# Altium project stm32f373-relay-control.PrjPcb
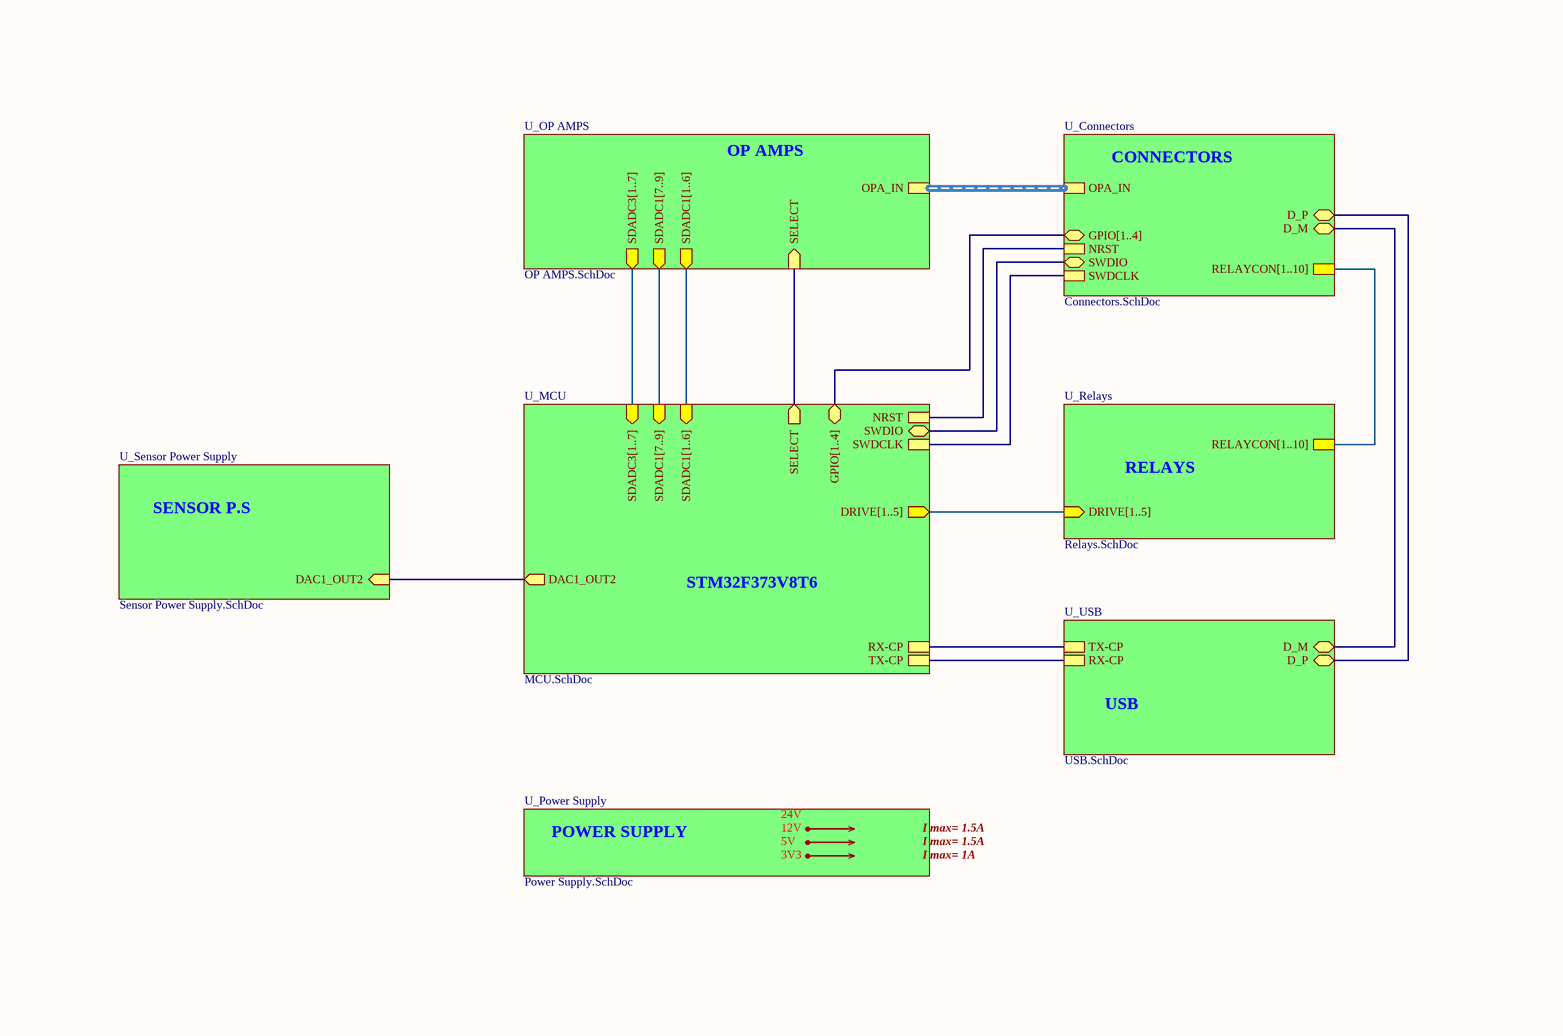
[diagram p0: stm32f373-relay-control.SchDoc]
8 sheets, 178 parts. Net scope: hierarchical (ports join the sheet entries above them; power ports are global).
Board file: stm32f373-relay-control.PcbDoc
Sheets:
  stm32f373-relay-control.SchDoc
    U_Connectors = Connectors.SchDoc
    U_OP AMPS = OP AMPS.SchDoc
    U_Power Supply = Power Supply.SchDoc
    U_Relays = Relays.SchDoc
    U_Sensor Power Supply = Sensor Power Supply.SchDoc
    U_USB = USB.SchDoc
    U_MCU = MCU.SchDoc

## Sheet stm32f373-relay-control.SchDoc: stm32f373-relay-control
size A4; Engineer: M.GUENI; Revision: R0; SheetNumber: 1; SheetTotal: 8

### Sub-sheets
U_Connectors = Connectors.SchDoc: RELAYCON[1..10], OPA_IN (harness OPA_IN), D_P (bidir), D_M (bidir), SWDIO (bidir), SWDCLK, NRST, GPIO[1..4] (bidir)
U_MCU = MCU.SchDoc: SDADC3[1..7] (in), SDADC1[1..6] (in), SDADC1[7..9] (in), DAC1_OUT2 (out), SELECT (out), DRIVE[1..5] (out), RX-CP, TX-CP, SWDIO (bidir), SWDCLK, NRST, GPIO[1..4] (bidir)
U_OP AMPS = OP AMPS.SchDoc: SDADC1[1..6] (out), SDADC1[7..9] (out), SDADC3[1..7] (out), OPA_IN (harness OPA_IN), SELECT (in)
U_Power Supply = Power Supply.SchDoc: no entries
U_Relays = Relays.SchDoc: RELAYCON[1..10], DRIVE[1..5] (in)
U_Sensor Power Supply = Sensor Power Supply.SchDoc: DAC1_OUT2 (in)
U_USB = USB.SchDoc: TX-CP, RX-CP, D_M (bidir), D_P (bidir)

### Nets
NRST: sheet U_Connectors/NRST, sheet U_MCU/NRST
SELECT: sheet U_OP AMPS/SELECT, sheet U_MCU/SELECT
NetD2_2: sheet U_Connectors/D_M, sheet U_USB/D_M
NetD2_3: sheet U_Connectors/D_P, sheet U_USB/D_P
NetJ11_1: sheet U_Connectors/SWDCLK, sheet U_MCU/SWDCLK
NetJ11_5: sheet U_Connectors/SWDIO, sheet U_MCU/SWDIO
NetR3_1: sheet U_USB/TX-CP, sheet U_MCU/RX-CP
NetR5_1: sheet U_USB/RX-CP, sheet U_MCU/TX-CP
NetU6_30: sheet U_Sensor Power Supply/DAC1_OUT2, sheet U_MCU/DAC1_OUT2

### Buses and harness runs
bus sheet U_Connectors/GPIO[1..4] = sheet U_MCU/GPIO[1..4]
bus sheet U_Connectors/RELAYCON[1..10] = sheet U_Relays/RELAYCON[1..10]
bus sheet U_MCU/DRIVE[1..5] = sheet U_Relays/DRIVE[1..5]
bus sheet U_MCU/SDADC1[1..6] = sheet U_OP AMPS/SDADC1[1..6]
bus sheet U_MCU/SDADC1[7..9] = sheet U_OP AMPS/SDADC1[7..9]
bus sheet U_MCU/SDADC3[1..7] = sheet U_OP AMPS/SDADC3[1..7]
harness sheet U_Connectors/OPA_IN = sheet U_OP AMPS/OPA_IN

### Notes on the sheet
- OP AMPS
- CONNECTORS
- SENSOR P.S
- RELAYS
- STM32F373V8T6
- USB
- POWER SUPPLY
- 12V
- 5V
- 24V
- I max= 1.5A
- 3V3
- I max= 1A
- THIS DOCUMENT AND THE DATA DISCLOSED HEREIN OR
- HEREWITH IS THE PROPERTY OF ALTIUM LIMITED AND MAY
- DWG NO:
- REVISION
- REV:
- DESCRIPTION
- DATE
- APPROVED
- BE FREELY DISTRIBUTED IN WHOLE. NO RIGHTS ARE
- RESERVED OR EXPRESS OR IMPLIED WARANTEE GIVEN.
- ENG:
- APPROVALS
- PROJECT
- DSN:
- CHK:
- REFERENCE DOCUMENTS
- PROJECT REVISION:
- TITLE
- DOCUMENT REVISION:
- DESIGN ITEM:
- BOM:
- FAB DWG:
- PCB DWG:
- ASSY DWG:
- SCALE:
- A3
- SIZE
- CAGE CODE
- FILE NAME
- DWG NO.
- SHEET
- OF
- REV

## Sheet Connectors.SchDoc: CONNECTORS
size A4; Engineer: M.GUENI; Organization: Altium Limited; Address1: L3, 12a Rodborough Rd; Address2: Frenchs Forest; Address3: NSW; Address4: Australia 2086; Revision: R0; SheetNumber: 4; SheetTotal: 8
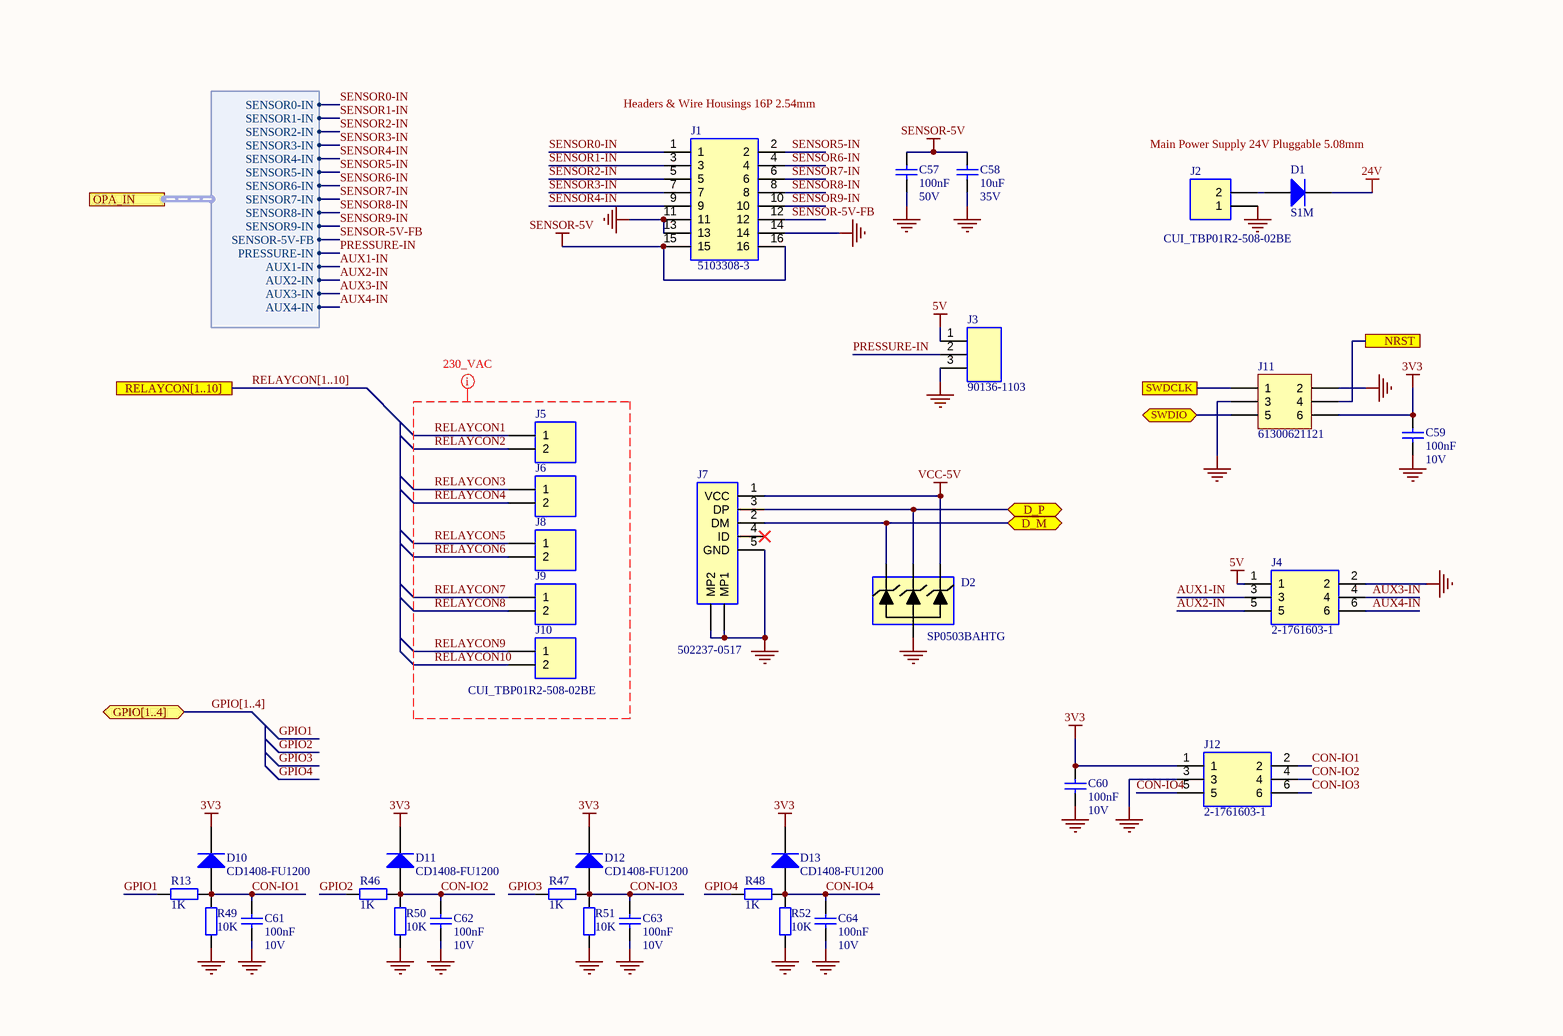
[diagram p1: Connectors.SchDoc]

### Parts
C57  Value 1: 100nF  Value 2: 50V  [CAPC1608N]  (hidden comment: Capacitor)
C58  Value 1: 10uF  Value 2: 35V  [CAPC1608N]  (hidden comment: Capacitor)
C59  Value 1: 100nF  Value 2: 10V  [CAPC1608N]  (hidden comment: Capacitor)
C60  Value 1: 100nF  Value 2: 10V  [CAPC1608N]  (hidden comment: Capacitor)
C61  Value 1: 100nF  Value 2: 10V  [CAPC1608N]  (hidden comment: Capacitor)
C62  Value 1: 100nF  Value 2: 10V  [CAPC1608N]  (hidden comment: Capacitor)
C63  Value 1: 100nF  Value 2: 10V  [CAPC1608N]  (hidden comment: Capacitor)
C64  Value 1: 100nF  Value 2: 10V  [CAPC1608N]  (hidden comment: Capacitor)
D1  S1M  [DIOM5227X270N]
D2  SP0503BAHTG  [SOT-143]
D10  CD1408-FU1200  [SOD-87]
D11  CD1408-FU1200  [SOD-87]
D12  CD1408-FU1200  [SOD-87]
D13  CD1408-FU1200  [SOD-87]
J1  5103308-3  [5103308-3]
J2  CUI_TBP01R2-508-02BE  [CUI_TBP01R2-508-02BE]
J3  90136-1103  [HDR1X3]
J4  2-1761603-1  [2-1761603-1]
J5  CUI_TBP01R2-508-02BE  [CUI_TBP01R2-508-02BE]
J6  CUI_TBP01R2-508-02BE  [CUI_TBP01R2-508-02BE]  (value not drawn)
J7  502237-0517  [502237-0517]
J8  CUI_TBP01R2-508-02BE  [CUI_TBP01R2-508-02BE]  (value not drawn)
J9  CUI_TBP01R2-508-02BE  [CUI_TBP01R2-508-02BE]  (value not drawn)
J10  CUI_TBP01R2-508-02BE  [CUI_TBP01R2-508-02BE]  (value not drawn)
J11  61300621121  [HDR2X3]
J12  2-1761603-1  [2-1761603-1]
R13  Value 1: 1K  [RESC1608N]  (hidden comment: Resistor)
R46  Value 1: 1K  [RESC1608N]  (hidden comment: Resistor)
R47  Value 1: 1K  [RESC1608N]  (hidden comment: Resistor)
R48  Value 1: 1K  [RESC1608N]  (hidden comment: Resistor)
R49  Value 1: 10K  [RESC1608N]  (hidden comment: Resistor)
R50  Value 1: 10K  [RESC1608N]  (hidden comment: Resistor)
R51  Value 1: 10K  [RESC1608N]  (hidden comment: Resistor)
R52  Value 1: 10K  [RESC1608N]  (hidden comment: Resistor)

### Ports
D_M (bidir), D_P (bidir), GPIO[1..4] (bidir), NRST, OPA_IN (harness OPA_IN), RELAYCON[1..10], SWDCLK, SWDIO (bidir)

### Harnesses
OPA_IN: SENSOR2-IN, SENSOR3-IN, SENSOR4-IN, SENSOR5-IN, SENSOR6-IN, SENSOR7-IN, SENSOR8-IN, SENSOR9-IN, SENSOR-5V-FB, PRESSURE-IN, AUX1-IN, AUX2-IN, SENSOR1-IN, AUX3-IN, SENSOR0-IN, AUX4-IN

### Nets
3V3: C59.2 C60.2 D10.1(K) D11.1(K) D12.1(K) D13.1(K) J11.6 J12.1
5V: J3.1 J4.1
24V: D1.1(K)
GND: C57.2 C58.2 C59.1 C60.1 C61.1 C62.1 C63.1 C64.1 D2.1 J1.11 J1.13 J1.14 J2.1 J3.3 J4.2 J7.5(GND) J7.MP1 J7.MP2 J11.2 J11.3 J12.3 R49.2 R50.2 R51.2 R52.2
SENSOR-5V: C57.1 C58.1 J1.15 J1.16
VCC-5V: D2.4 J7.1(VCC)
AUX1-IN: J4.3 ; port OPA_IN.AUX1-IN
AUX2-IN: J4.5 ; port OPA_IN.AUX2-IN
AUX3-IN: J4.4 ; port OPA_IN.AUX3-IN
AUX4-IN: J4.6 ; port OPA_IN.AUX4-IN
CON-IO1: C61.2 D10.2(A) J12.2 R13.1 R49.1
CON-IO2: C62.2 D11.2(A) J12.4 R46.1 R50.1
CON-IO3: C63.2 D12.2(A) J12.6 R47.1 R51.1
CON-IO4: C64.2 D13.2(A) J12.5 R48.1 R52.1
GPIO1: R13.2
GPIO2: R46.2
GPIO3: R47.2
GPIO4: R48.2
NRST: J11.4 ; port NRST
PRESSURE-IN: J3.2 ; port OPA_IN.PRESSURE-IN
RELAYCON1: J5.1
RELAYCON2: J5.2
RELAYCON3: J6.1
RELAYCON4: J6.2
RELAYCON5: J8.1
RELAYCON6: J8.2
RELAYCON7: J9.1
RELAYCON8: J9.2
RELAYCON9: J10.1
RELAYCON10: J10.2
SENSOR0-IN: J1.1 ; port OPA_IN.SENSOR0-IN
SENSOR1-IN: J1.3 ; port OPA_IN.SENSOR1-IN
SENSOR2-IN: J1.5 ; port OPA_IN.SENSOR2-IN
SENSOR3-IN: J1.7 ; port OPA_IN.SENSOR3-IN
SENSOR4-IN: J1.9 ; port OPA_IN.SENSOR4-IN
SENSOR5-IN: J1.2 ; port OPA_IN.SENSOR5-IN
SENSOR6-IN: J1.4 ; port OPA_IN.SENSOR6-IN
SENSOR7-IN: J1.6 ; port OPA_IN.SENSOR7-IN
SENSOR8-IN: J1.8 ; port OPA_IN.SENSOR8-IN
SENSOR9-IN: J1.10 ; port OPA_IN.SENSOR9-IN
SENSOR-5V-FB: J1.12 ; port OPA_IN.SENSOR-5V-FB
NetD1_2: D1.2(A) J2.2
NetD2_2: D2.2 J7.2(DM) ; port D_M
NetD2_3: D2.3 J7.3(DP) ; port D_P
NetJ11_1: J11.1 ; port SWDCLK
NetJ11_5: J11.5 ; port SWDIO

Not connected (* = marked no-connect by the designer): J7 4(ID)*

### Buses and harness runs
bus GPIO[1..4] = port GPIO[1..4]
bus RELAYCON[1..10] = port RELAYCON[1..10]

### Layout directives
net class 230_VAC: RELAYCON1, RELAYCON2, RELAYCON3, RELAYCON4, RELAYCON5, RELAYCON6, RELAYCON7, RELAYCON8, RELAYCON9, RELAYCON10

### Notes on the sheet
- (near J1) Headers & Wire Housings 16P 2.54mm
- Main Power Supply 24V Pluggable 5.08mm
- THIS DOCUMENT AND THE DATA DISCLOSED HEREIN OR
- HEREWITH IS THE PROPERTY OF ALTIUM LIMITED AND MAY
- DWG NO:
- REVISION
- REV:
- DESCRIPTION
- DATE
- APPROVED
- BE FREELY DISTRIBUTED IN WHOLE. NO RIGHTS ARE
- RESERVED OR EXPRESS OR IMPLIED WARANTEE GIVEN.
- ENG:
- APPROVALS
- PROJECT
- DSN:
- CHK:
- REFERENCE DOCUMENTS
- PROJECT REVISION:
- TITLE
- DOCUMENT REVISION:
- DESIGN ITEM:
- BOM:
- FAB DWG:
- PCB DWG:
- ASSY DWG:
- SCALE:
- A3
- SIZE
- CAGE CODE
- FILE NAME
- DWG NO.
- SHEET
- OF
- REV

### Library data of the parts
C57 = CAP-000000002: MAN: VISHAY; MANREF: VJ0603V104ZXAPW1BC; DES: VJ0603V104ZXAPW1BC -  Condensateur céramique multicouche CMS, 0.1 µF, 50 V, 0603 [1608 Metric], +80%, -20%, Y5V; TOL: +80% -20%; FTP: 0603; SUP: Farnell; SUPREF: 2896408; NOTE: _; Part Number: CAP-000000002
C58 = CAP-000000006: MAN: Murata Electronics; MANREF: GRM188R6YA106MA73D; DES: Multilayer Ceramic Capacitors MLCC - SMD/SMT 0603 10uF 35volts *Derate Voltage/Temp; TOL: 20%; FTP: 0603; SUP: Mouser; SUPREF: 81-GRM188R6YA106MA3D; NOTE: _; Part Number: CAP-000000006
C59-C64 = CAP-000000005: MAN: KEMET; MANREF: C0603X104K8RACTU; DES: C0603X104K8RACTU -  Condensateur céramique multicouche CMS, 0.1 µF, 10 V, 0603 [1608 Metric], ± 10%, X7R; TOL: 10%; FTP: 0603; SUP: Farnell; SUPREF: 2904937; NOTE: _; Part Number: CAP-000000005
D1 = DIR-000000001: MAN: ON Semiconductor / Fairchild; DES: Rectifiers 1.0A 1000V; Value 1: 1A; Value 2: 1000V; TOL: _; FTP: DO-214AC; SUP: Mouser; SUPREF: 512-S1M; Part Number: DIR-000000001; MANREF: S1M; NOTE: _
D2 = TVS-000000009: MAN: Littelfuse; DES: ESD Suppressors / TVS Diodes TVS AVAL DIODE SMT; Value 1: 5.5 V; Value 2: 30 pF; TOL: _; SUP: Mouser; SUPREF: 576-SP0503BAHTG; Part Number: TVS-000000009; MANREF: SP0503BAHTG; FTP: SOT-143; NOTE: _
D10-D13 = DIR-000000003: MAN: Bourns; DES: Rectifiers RECTIFIER DIODE SMD 200VOLT; Value 1: 1A; Value 2: 200 V; TOL: _; SUP: Mouser; SUPREF: 652-CD1408-FU1200; Part Number: DIR-000000003; MANREF: CD1408-FU1200; FTP: SOD-87; NOTE: _
J1 = CON-000000002: MAN: TE Connectivity; DES: Headers & Wire Housings 16P 2 ROW HEADER LP; Value 1: 16pts; Value 2: 2.54mm; TOL: _; FTP: THT; SUP: Mouser; SUPREF: 571-5103308-3; Part Number: CON-000000002; MANREF: 5103308-3; NOTE: _
J2 J5 J6 J8-J10 = CON-000000001: MAN: CUI Devices; MANREF: TBP01R2-508-02BE / 39910-0102; DES: Pluggable Terminal Blocks Terminal block, pluggable, 5.08, receptical, 2 pole, blue; Value 1: 2pts; Value 2: 5.08 mm; TOL: _; FTP: THT; SUP: Mouser; SUPREF: 490-TBP01R2-508-02BE; Part Number: CON-000000001; NOTE: _
J3 = CON-000000004: MAN: Molex; DES: Headers & Wire Housings 2.54MM CGRIDIII HDR 3P V SR SHRD TIN; Value 1: 3pts; Value 2: 2,54 mm; TOL: _; FTP: THT; SUP: Mouser; SUPREF: 538-90136-1103; Part Number: CON-000000004; MANREF: 90136-1103; NOTE: _
J4 J12 = CON-000000003: MAN: TE Connectivity; DES: Headers & Wire Housings IDC HDR 6P VERT BLUE LOW PRO; Value 1: 6pts; Value 2: 2.54mm; FTP: THT; SUP: Mouser; SUPREF: 571-2-1761603-1; NOTE: _; Part Number: CON-000000003; MANREF: 2-1761603-1
J7 = CON-000000005: MAN: Molex; DES: USB Connectors USB Mini-B Rec Hsg Assy S/T 5Ckt; Value 1: _; FTP: THT; SUP: Mouser; SUPREF: 538-502237-0517; Part Number: CON-000000005; MANREF: 502237-0517; Value 2: _; TOL: _; NOTE: _
J11 = CON-000000006: MAN: Wurth Electronics; DES: Embases et logements de câbles WR-PHD 2.54mm Hdr 6P Dual Str Gold; Value 1: 6pts; Value 2: _; FTP: THT; SUP: Mouser; SUPREF: 710-61300621121; Part Number: CON-000000006; MANREF: 61300621121; TOL: _; NOTE: _
R13 R46-R48 = RES-000000006: MAN: TE Connectivity / Neohm; MANREF: CPF0603F1K0C1; DES: Thin Film Resistors - SMD 1KOhm .063W 50PPM; Value 2: 0.625W; TOL: 1%; FTP: 0603; SUP: Mouser; SUPREF: 279-CPF0603F1K0C1; NOTE: _; Part Number: RES-000000006
R49-R52 = RES-000000001: MAN: YAGEO; MANREF: RC0603FR-0710KL; DES: YAGEO (PHYCOMP)  RC0603FR-0710KL  RESISTANCE COUCHE EPAISSE 10K 0.1W 1%; Value 2: 0.1W; TOL: 1%; FTP: 0603; SUP: Farnell; SUPREF: 9238603; NOTE: _; Part Number: RES-000000001

## Sheet OP AMPS.SchDoc
size 420 x 297 mm; Organization: Altium Limited; Address1: L3, 12a Rodborough Rd; Address2: Frenchs Forest; Address3: NSW; Address4: Australia 2086; Revision: R0; SheetNumber: 5; SheetTotal: 8
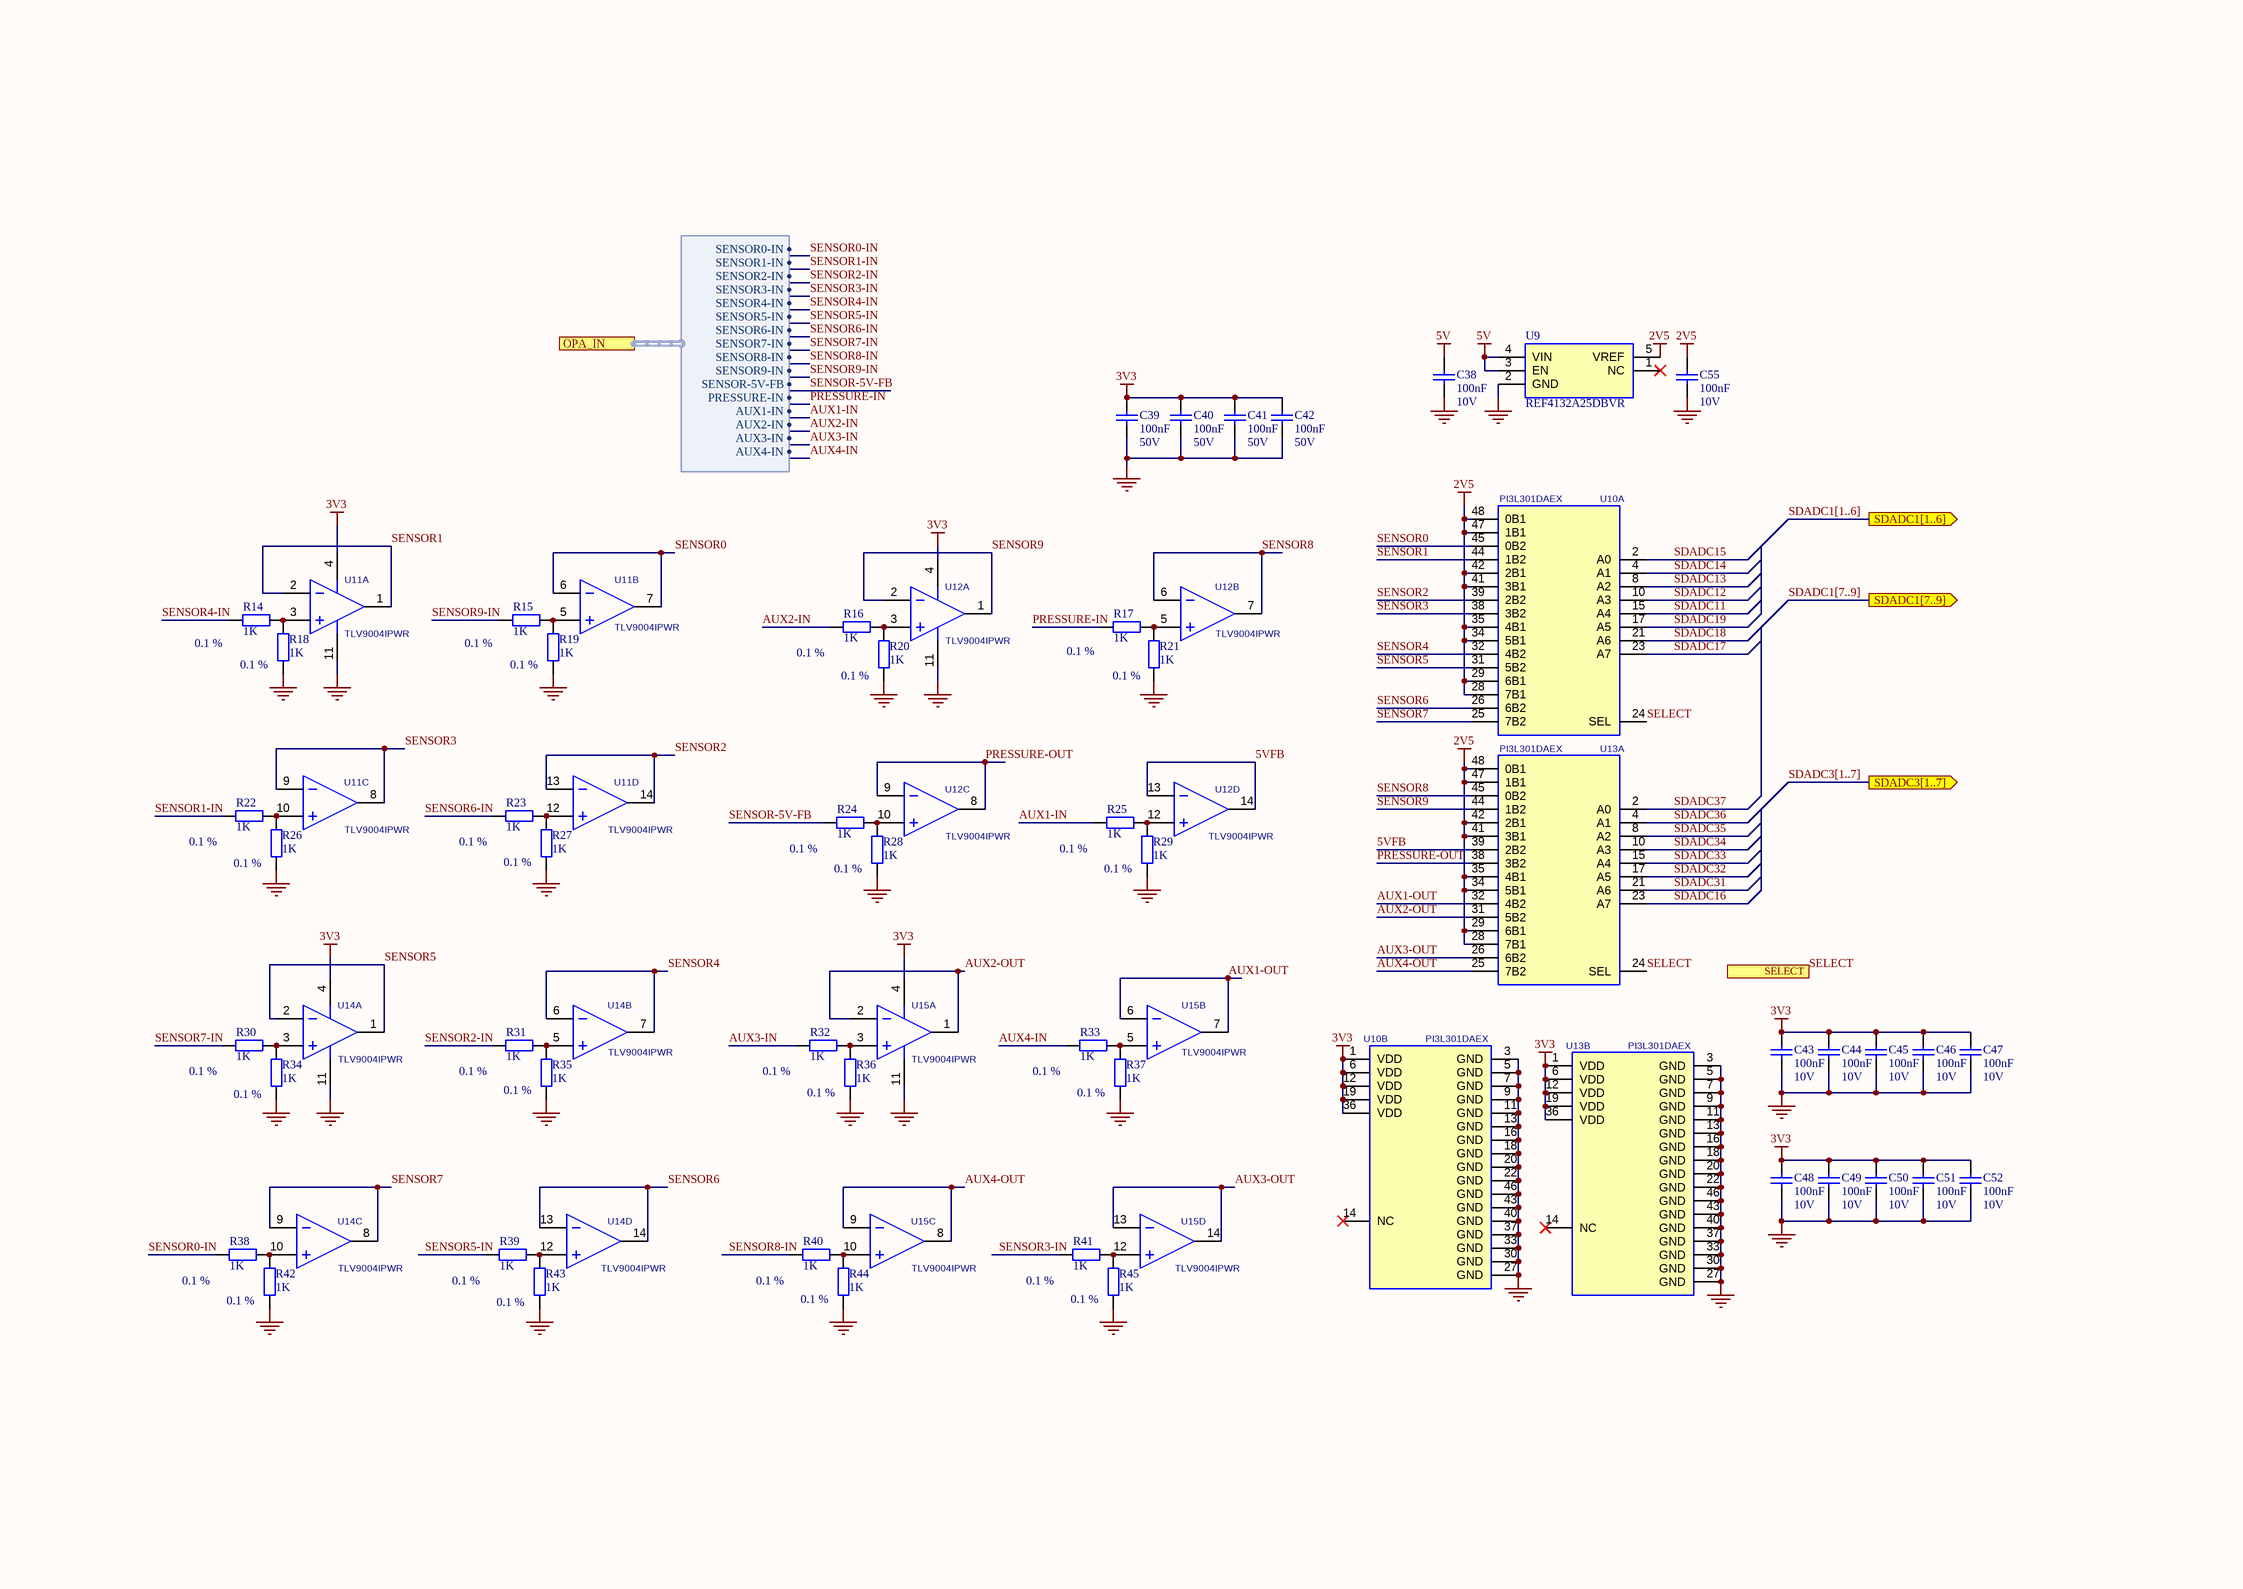
[diagram p2: OP AMPS.SchDoc]

### Parts
C38  Value 1: 100nF  Value 2: 10V  [CAPC1608N]  (hidden comment: Capacitor)
C39  Value 1: 100nF  Value 2: 50V  [CAPC1608N]  (hidden comment: Capacitor)
C40  Value 1: 100nF  Value 2: 50V  [CAPC1608N]  (hidden comment: Capacitor)
C41  Value 1: 100nF  Value 2: 50V  [CAPC1608N]  (hidden comment: Capacitor)
C42  Value 1: 100nF  Value 2: 50V  [CAPC1608N]  (hidden comment: Capacitor)
C43  Value 1: 100nF  Value 2: 10V  [CAPC1608N]  (hidden comment: Capacitor)
C44  Value 1: 100nF  Value 2: 10V  [CAPC1608N]  (hidden comment: Capacitor)
C45  Value 1: 100nF  Value 2: 10V  [CAPC1608N]  (hidden comment: Capacitor)
C46  Value 1: 100nF  Value 2: 10V  [CAPC1608N]  (hidden comment: Capacitor)
C47  Value 1: 100nF  Value 2: 10V  [CAPC1608N]  (hidden comment: Capacitor)
C48  Value 1: 100nF  Value 2: 10V  [CAPC1608N]  (hidden comment: Capacitor)
C49  Value 1: 100nF  Value 2: 10V  [CAPC1608N]  (hidden comment: Capacitor)
C50  Value 1: 100nF  Value 2: 10V  [CAPC1608N]  (hidden comment: Capacitor)
C51  Value 1: 100nF  Value 2: 10V  [CAPC1608N]  (hidden comment: Capacitor)
C52  Value 1: 100nF  Value 2: 10V  [CAPC1608N]  (hidden comment: Capacitor)
C55  Value 1: 100nF  Value 2: 10V  [CAPC1608N]  (hidden comment: Capacitor)
R14  Value 1: 1K  TOL: 0.1 %  [RESC1608N]  (hidden comment: Resistor)
R15  Value 1: 1K  TOL: 0.1 %  [RESC1608N]  (hidden comment: Resistor)
R16  Value 1: 1K  TOL: 0.1 %  [RESC1608N]  (hidden comment: Resistor)
R17  Value 1: 1K  TOL: 0.1 %  [RESC1608N]  (hidden comment: Resistor)
R18  Value 1: 1K  TOL: 0.1 %  [RESC1608N]  (hidden comment: Resistor)
R19  Value 1: 1K  TOL: 0.1 %  [RESC1608N]  (hidden comment: Resistor)
R20  Value 1: 1K  TOL: 0.1 %  [RESC1608N]  (hidden comment: Resistor)
R21  Value 1: 1K  TOL: 0.1 %  [RESC1608N]  (hidden comment: Resistor)
R22  Value 1: 1K  TOL: 0.1 %  [RESC1608N]  (hidden comment: Resistor)
R23  Value 1: 1K  TOL: 0.1 %  [RESC1608N]  (hidden comment: Resistor)
R24  Value 1: 1K  TOL: 0.1 %  [RESC1608N]  (hidden comment: Resistor)
R25  Value 1: 1K  TOL: 0.1 %  [RESC1608N]  (hidden comment: Resistor)
R26  Value 1: 1K  TOL: 0.1 %  [RESC1608N]  (hidden comment: Resistor)
R27  Value 1: 1K  TOL: 0.1 %  [RESC1608N]  (hidden comment: Resistor)
R28  Value 1: 1K  TOL: 0.1 %  [RESC1608N]  (hidden comment: Resistor)
R29  Value 1: 1K  TOL: 0.1 %  [RESC1608N]  (hidden comment: Resistor)
R30  Value 1: 1K  TOL: 0.1 %  [RESC1608N]  (hidden comment: Resistor)
R31  Value 1: 1K  TOL: 0.1 %  [RESC1608N]  (hidden comment: Resistor)
R32  Value 1: 1K  TOL: 0.1 %  [RESC1608N]  (hidden comment: Resistor)
R33  Value 1: 1K  TOL: 0.1 %  [RESC1608N]  (hidden comment: Resistor)
R34  Value 1: 1K  TOL: 0.1 %  [RESC1608N]  (hidden comment: Resistor)
R35  Value 1: 1K  TOL: 0.1 %  [RESC1608N]  (hidden comment: Resistor)
R36  Value 1: 1K  TOL: 0.1 %  [RESC1608N]  (hidden comment: Resistor)
R37  Value 1: 1K  TOL: 0.1 %  [RESC1608N]  (hidden comment: Resistor)
R38  Value 1: 1K  TOL: 0.1 %  [RESC1608N]  (hidden comment: Resistor)
R39  Value 1: 1K  TOL: 0.1 %  [RESC1608N]  (hidden comment: Resistor)
R40  Value 1: 1K  TOL: 0.1 %  [RESC1608N]  (hidden comment: Resistor)
R41  Value 1: 1K  TOL: 0.1 %  [RESC1608N]  (hidden comment: Resistor)
R42  Value 1: 1K  TOL: 0.1 %  [RESC1608N]  (hidden comment: Resistor)
R43  Value 1: 1K  TOL: 0.1 %  [RESC1608N]  (hidden comment: Resistor)
R44  Value 1: 1K  TOL: 0.1 %  [RESC1608N]  (hidden comment: Resistor)
R45  Value 1: 1K  TOL: 0.1 %  [RESC1608N]  (hidden comment: Resistor)
U9  REF4132A25DBVR  [SOT-23-5]
U10  PI3L301DAEX  [SOP-48]  (parts A,B of 2)
U11  TLV9004IPWR  [TSSOP-14]  (parts A,B,C,D of 4)
U12  TLV9004IPWR  [TSSOP-14]  (parts A,B,C,D of 4)
U13  PI3L301DAEX  [SOP-48]  (parts A,B of 2)
U14  TLV9004IPWR  [TSSOP-14]  (parts A,B,C,D of 4)
U15  TLV9004IPWR  [TSSOP-14]  (parts A,B,C,D of 4)

### Ports
OPA_IN (harness OPA_IN), SDADC1[1..6] (out), SDADC1[7..9] (out), SDADC3[1..7] (out), SELECT (in)

### Harnesses
OPA_IN: SENSOR2-IN, SENSOR3-IN, SENSOR4-IN, SENSOR5-IN, SENSOR6-IN, SENSOR7-IN, SENSOR8-IN, SENSOR9-IN, SENSOR-5V-FB, PRESSURE-IN, AUX1-IN, AUX2-IN, SENSOR1-IN, AUX3-IN, SENSOR0-IN, AUX4-IN

### Nets
2V5: C55.2 U9.5(VREF) U10.28(7B1) U10.29(6B1) U10.34(5B1) U10.35(4B1) U10.41(3B1) U10.42(2B1) U10.47(1B1) U10.48(0B1) U13.28(7B1) U13.29(6B1) U13.34(5B1) U13.35(4B1) U13.41(3B1) U13.42(2B1) U13.47(1B1) U13.48(0B1)
3V3: C39.1 C40.1 C41.1 C42.1 C43.2 C44.2 C45.2 C46.2 C47.2 C48.2 C49.2 C50.2 C51.2 C52.2 U10.1(VDD) U10.6(VDD) U10.12(VDD) U10.19(VDD) U10.36(VDD) U11.4(+V) U12.4(+V) U13.1(VDD) U13.6(VDD) U13.12(VDD) U13.19(VDD) U13.36(VDD) U14.4(+V) U15.4(+V)
5V: C38.2 U9.3(EN) U9.4(VIN)
GND: C38.1 C39.2 C40.2 C41.2 C42.2 C43.1 C44.1 C45.1 C46.1 C47.1 C48.1 C49.1 C50.1 C51.1 C52.1 C55.1 R18.2 R19.2 R20.2 R21.2 R26.2 R27.2 R28.2 R29.2 R34.2 R35.2 R36.2 R37.2 R42.2 R43.2 R44.2 R45.2 U9.2(GND) U10.3(GND) U10.5(GND) U10.7(GND) U10.9(GND) U10.11(GND) U10.13(GND) U10.16(GND) U10.18(GND) U10.20(GND) U10.22(GND) U10.27(GND) U10.30(GND) U10.33(GND) U10.37(GND) U10.40(GND) U10.43(GND) U10.46(GND) U11.11(-V) U12.11(-V) U13.3(GND) U13.5(GND) U13.7(GND) U13.9(GND) U13.11(GND) U13.13(GND) U13.16(GND) U13.18(GND) U13.20(GND) U13.22(GND) U13.27(GND) U13.30(GND) U13.33(GND) U13.37(GND) U13.40(GND) U13.43(GND) U13.46(GND) U14.11(-V) U15.11(-V)
5VFB: U12.13(–IN_D) U12.14(OUT_D) U13.39(2B2)
AUX1-IN: R25.1 ; port OPA_IN.AUX1-IN
AUX1-OUT: U13.32(4B2) U15.6(–IN_B) U15.7(OUT_B)
AUX2-IN: R16.1 ; port OPA_IN.AUX2-IN
AUX2-OUT: U13.31(5B2) U15.1(OUT_A) U15.2(-IN_A)
AUX3-IN: R32.1 ; port OPA_IN.AUX3-IN
AUX3-OUT: U13.26(6B2) U15.13(–IN_D) U15.14(OUT_D)
AUX4-IN: R33.1 ; port OPA_IN.AUX4-IN
AUX4-OUT: U13.25(7B2) U15.8(OUT_C) U15.9(–IN_C)
PRESSURE-IN: R17.1 ; port OPA_IN.PRESSURE-IN
PRESSURE-OUT: U12.8(OUT_C) U12.9(–IN_C) U13.38(3B2)
SDADC11: U10.15(A4)
SDADC12: U10.10(A3)
SDADC13: U10.8(A2)
SDADC14: U10.4(A1)
SDADC15: U10.2(A0)
SDADC16: U13.23(A7)
SDADC17: U10.23(A7)
SDADC18: U10.21(A6)
SDADC19: U10.17(A5)
SDADC31: U13.21(A6)
SDADC32: U13.17(A5)
SDADC33: U13.15(A4)
SDADC34: U13.10(A3)
SDADC35: U13.8(A2)
SDADC36: U13.4(A1)
SDADC37: U13.2(A0)
SELECT: U10.24(SEL) U13.24(SEL) ; port SELECT
SENSOR0: U10.45(0B2) U11.6(–IN_B) U11.7(OUT_B)
SENSOR0-IN: R38.1 ; port OPA_IN.SENSOR0-IN
SENSOR1: U10.44(1B2) U11.1(OUT_A) U11.2(-IN_A)
SENSOR1-IN: R22.1 ; port OPA_IN.SENSOR1-IN
SENSOR2: U10.39(2B2) U11.13(–IN_D) U11.14(OUT_D)
SENSOR2-IN: R31.1 ; port OPA_IN.SENSOR2-IN
SENSOR3: U10.38(3B2) U11.8(OUT_C) U11.9(–IN_C)
SENSOR3-IN: R41.1 ; port OPA_IN.SENSOR3-IN
SENSOR4: U10.32(4B2) U14.6(–IN_B) U14.7(OUT_B)
SENSOR4-IN: R14.1 ; port OPA_IN.SENSOR4-IN
SENSOR5: U10.31(5B2) U14.1(OUT_A) U14.2(-IN_A)
SENSOR5-IN: R39.1 ; port OPA_IN.SENSOR5-IN
SENSOR6: U10.26(6B2) U14.13(–IN_D) U14.14(OUT_D)
SENSOR6-IN: R23.1 ; port OPA_IN.SENSOR6-IN
SENSOR7: U10.25(7B2) U14.8(OUT_C) U14.9(–IN_C)
SENSOR7-IN: R30.1 ; port OPA_IN.SENSOR7-IN
SENSOR8: U12.6(–IN_B) U12.7(OUT_B) U13.45(0B2)
SENSOR8-IN: R40.1 ; port OPA_IN.SENSOR8-IN
SENSOR9: U12.1(OUT_A) U12.2(-IN_A) U13.44(1B2)
SENSOR9-IN: R15.1 ; port OPA_IN.SENSOR9-IN
SENSOR-5V-FB: R24.1 ; port OPA_IN.SENSOR-5V-FB
NetR14_2: R14.2 R18.1 U11.3(+IN_A)
NetR15_2: R15.2 R19.1 U11.5(+IN_B)
NetR16_2: R16.2 R20.1 U12.3(+IN_A)
NetR17_2: R17.2 R21.1 U12.5(+IN_B)
NetR22_2: R22.2 R26.1 U11.10(+IN_C)
NetR23_2: R23.2 R27.1 U11.12(+IN_D)
NetR24_2: R24.2 R28.1 U12.10(+IN_C)
NetR25_2: R25.2 R29.1 U12.12(+IN_D)
NetR30_2: R30.2 R34.1 U14.3(+IN_A)
NetR31_2: R31.2 R35.1 U14.5(+IN_B)
NetR32_2: R32.2 R36.1 U15.3(+IN_A)
NetR33_2: R33.2 R37.1 U15.5(+IN_B)
NetR38_2: R38.2 R42.1 U14.10(+IN_C)
NetR39_2: R39.2 R43.1 U14.12(+IN_D)
NetR40_2: R40.2 R44.1 U15.10(+IN_C)
NetR41_2: R41.2 R45.1 U15.12(+IN_D)

Not connected (* = marked no-connect by the designer): U9 1(NC)*; U10 14(NC)*; U13 14(NC)*

### Buses and harness runs
bus SDADC1[1..6] = port SDADC1[1..6]
bus SDADC1[7..9] = port SDADC1[7..9]
bus SDADC3[1..7] = port SDADC3[1..7]

### Notes on the sheet
- THIS DOCUMENT AND THE DATA DISCLOSED HEREIN OR
- HEREWITH IS THE PROPERTY OF ALTIUM LIMITED AND MAY
- DWG NO:
- REVISION
- REV:
- DESCRIPTION
- DATE
- APPROVED
- BE FREELY DISTRIBUTED IN WHOLE. NO RIGHTS ARE
- RESERVED OR EXPRESS OR IMPLIED WARANTEE GIVEN.
- ENG:
- APPROVALS
- PROJECT
- DSN:
- CHK:
- REFERENCE DOCUMENTS
- PROJECT REVISION:
- TITLE
- DOCUMENT REVISION:
- DESIGN ITEM:
- BOM:
- FAB DWG:
- PCB DWG:
- ASSY DWG:
- SCALE:
- A3
- SIZE
- CAGE CODE
- FILE NAME
- DWG NO.
- SHEET
- OF
- REV

### Library data of the parts
C38 C43-C52 C55 = CAP-000000005: as C59 on sheet Connectors; Part Number: CAP-000000005
C39-C42 = CAP-000000002: as C57 on sheet Connectors; Part Number: CAP-000000002
R14-R45 = RES-000000112: MAN: TE Connectivity; MANREF: CPF0603B1K0E1; DES: Thin Film Resistors - SMD 1KOhm .063W 25PPM; Value 2: 0.625W; FTP: 0603; SUP: Mouser; SUPREF: 279-CPF0603B1K0E1; NOTE: _; Part Number: RES-000000112
U9 = VRF-000000002: MAN: Texas Instruments; DES: Voltage References 12-ppm/ C low-noise low-power precision voltage reference; Value 1: 2.5 V; Value 2: _; TOL: 0.05 %; SUP: Mouser; SUPREF: 595-REF4132A25DBVR; Part Number: VRF-000000002; MANREF: REF4132A25DBVR; FTP: SOT-23-5; NOTE: _
U10 U13 = MIS-000000001: MAN: DIODES INC; DES: Commutateur analogique, 8 Canal(aux), SPDT, 8 ohm, 3V à 3.6V, TSSOP, 48 Broche(s); Value 1: _; SUP: Farneel; SUPREF: 3483212; Part Number: MIS-000000001; MANREF: PI3L301DAEX; Value 2: _; TOL: _; FTP: SOP-48; NOTE: _
U11 U12 U14 U15 = OPA-000000002: MAN: Texas Instrument; DES: Operational Amplifiers - Op Amps 4-Channel, 1MHz, RRIO, 1.8V to 5.5V Operational Amplifier for Cost-Optimized Systems 14-TSSOP -40 to 125; Value 1: _; SUP: Mouser; SUPREF: 595-TLV9004IPWR; Part Number: OPA-000000002; MANREF: TLV9004IPWR; Value 2: _; TOL: _; FTP: TSSOP-14; NOTE: _

## Sheet Power Supply.SchDoc: Power Supply
size A4; Engineer: M.GUENI; Organization: Altium Limited; Address1: L3, 12a Rodborough Rd; Address2: Frenchs Forest; Address3: NSW; Address4: Australia 2086; Revision: R0; SheetNumber: 2; SheetTotal: 8
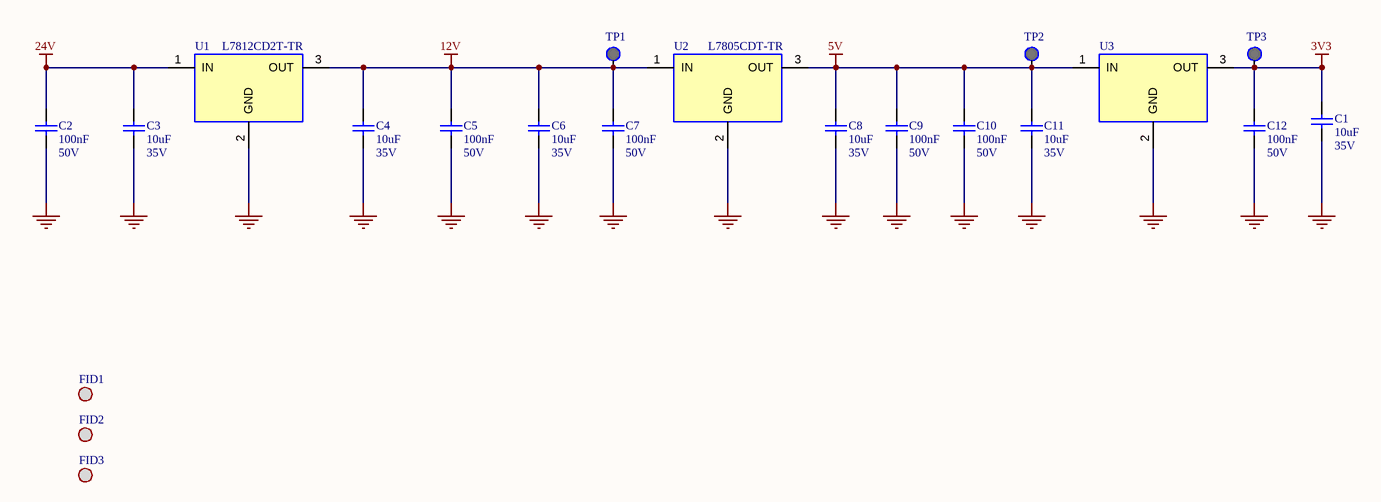
[diagram p3: Power Supply.SchDoc]

### Parts
C1  Value 1: 10uF  Value 2: 35V  [CAPC1608N]  (hidden comment: Capacitor)
C2  Value 1: 100nF  Value 2: 50V  [CAPC1608N]  (hidden comment: Capacitor)
C3  Value 1: 10uF  Value 2: 35V  [CAPC1608N]  (hidden comment: Capacitor)
C4  Value 1: 10uF  Value 2: 35V  [CAPC1608N]  (hidden comment: Capacitor)
C5  Value 1: 100nF  Value 2: 50V  [CAPC1608N]  (hidden comment: Capacitor)
C6  Value 1: 10uF  Value 2: 35V  [CAPC1608N]  (hidden comment: Capacitor)
C7  Value 1: 100nF  Value 2: 50V  [CAPC1608N]  (hidden comment: Capacitor)
C8  Value 1: 10uF  Value 2: 35V  [CAPC1608N]  (hidden comment: Capacitor)
C9  Value 1: 100nF  Value 2: 50V  [CAPC1608N]  (hidden comment: Capacitor)
C10  Value 1: 100nF  Value 2: 50V  [CAPC1608N]  (hidden comment: Capacitor)
C11  Value 1: 10uF  Value 2: 35V  [CAPC1608N]  (hidden comment: Capacitor)
C12  Value 1: 100nF  Value 2: 50V  [CAPC1608N]  (hidden comment: Capacitor)
FID1  Fiducial  [FIDUCIAL-1MM]  (value not drawn)
FID2  Fiducial  [FIDUCIAL-1MM]  (value not drawn)
FID3  Fiducial  [FIDUCIAL-1MM]  (value not drawn)
TP1  Test Point  [TP]  (value not drawn)  (no BOM)
TP2  Test Point  [TP]  (value not drawn)  (no BOM)
TP3  Test Point  [TP]  (value not drawn)  (no BOM)
U1  L7812CD2T-TR  [D2PAK]
U2  L7805CDT-TR  [D2PAK]
U3  (no value)  [DPAK]

### Nets
3V3: C1.2 C12.1 TP3.1 U3.3(OUT)
5V: C8.2 C9.1 C10.1 C11.2 TP2.1 U2.3(OUT) U3.1(IN)
12V: C4.2 C5.1 C6.2 C7.1 TP1.1 U1.3(OUT) U2.1(IN)
24V: C2.1 C3.2 U1.1(IN)
GND: C1.1 C2.2 C3.1 C4.1 C5.2 C6.1 C7.2 C8.1 C9.2 C10.2 C11.1 C12.2 U1.2(GND) U2.2(GND) U3.2(GND)

### Notes on the sheet
- THIS DOCUMENT AND THE DATA DISCLOSED HEREIN OR
- HEREWITH IS THE PROPERTY OF ALTIUM LIMITED AND MAY
- DWG NO:
- REVISION
- REV:
- DESCRIPTION
- DATE
- APPROVED
- BE FREELY DISTRIBUTED IN WHOLE. NO RIGHTS ARE
- RESERVED OR EXPRESS OR IMPLIED WARANTEE GIVEN.
- ENG:
- APPROVALS
- PROJECT
- DSN:
- CHK:
- REFERENCE DOCUMENTS
- PROJECT REVISION:
- TITLE
- DOCUMENT REVISION:
- DESIGN ITEM:
- BOM:
- FAB DWG:
- PCB DWG:
- ASSY DWG:
- SCALE:
- A3
- SIZE
- CAGE CODE
- FILE NAME
- DWG NO.
- SHEET
- OF
- REV

### Library data of the parts
C1 C3 C4 C6 C8 C11 = CAP-000000006: as C58 on sheet Connectors; Part Number: CAP-000000006
C2 C5 C7 C9 C10 C12 = CAP-000000002: as C57 on sheet Connectors; Part Number: CAP-000000002
FID1-FID3 = MIS-000000004: MAN: _; Value 1: 1mm; Part Number: MIS-000000004; MANREF: _; DES: _; Value 2: _; TOL: _; FTP: _; SUP: _; SUPREF: _; NOTE: _
TP1-TP3 = MIS-000000003: MAN: _; Part Number: MIS-000000003; MANREF: _; DES: _; Value 1: _; Value 2: _; TOL: _; FTP: _; SUP: _; SUPREF: _; NOTE: _
U1 = VRG-000000002: MAN: STMicroelectronics; DES: Linear Voltage Regulators 12V 1.5A Positive; Value 1: 12V; Value 2: 1.5A; TOL: _; SUP: Mouser; SUPREF: 511-L7812CD2T-TR; Part Number: VRG-000000002; MANREF: L7812CD2T-TR; FTP: D2PAK; NOTE: _
U2 = VRG-000000001: MAN: STMicroelectronics; DES: Linear Voltage Regulators 5.0V 1.5A Positive; Value 1: 5V; Value 2: 1.5A; TOL: _; SUP: Mouser; SUPREF: 511-L7805CDT-TR; Part Number: VRG-000000001; MANREF: L7805CDT-TR; FTP: D2PAK; NOTE: _
U3 = VRG-000000003: MAN: STMicroelectronics; MANREF: LF33CDT-TRY; DES: Linear Voltage Regulators VLDV Reg Inhibit 0.45V 50uA 500mA; Value 1: 3V3; Value 2: 1A; TOL: _; SUP: Mouser; SUPREF: 511-LF33CDT-TRY; Part Number: VRG-000000003; FTP: DPAK; NOTE: _

## Sheet Relays.SchDoc: Relays
size A4; Engineer: M.GUENI; Organization: Altium Limited; Address1: L3, 12a Rodborough Rd; Address2: Frenchs Forest; Address3: NSW; Address4: Australia 2086; Revision: R0; SheetNumber: 3; SheetTotal: 8
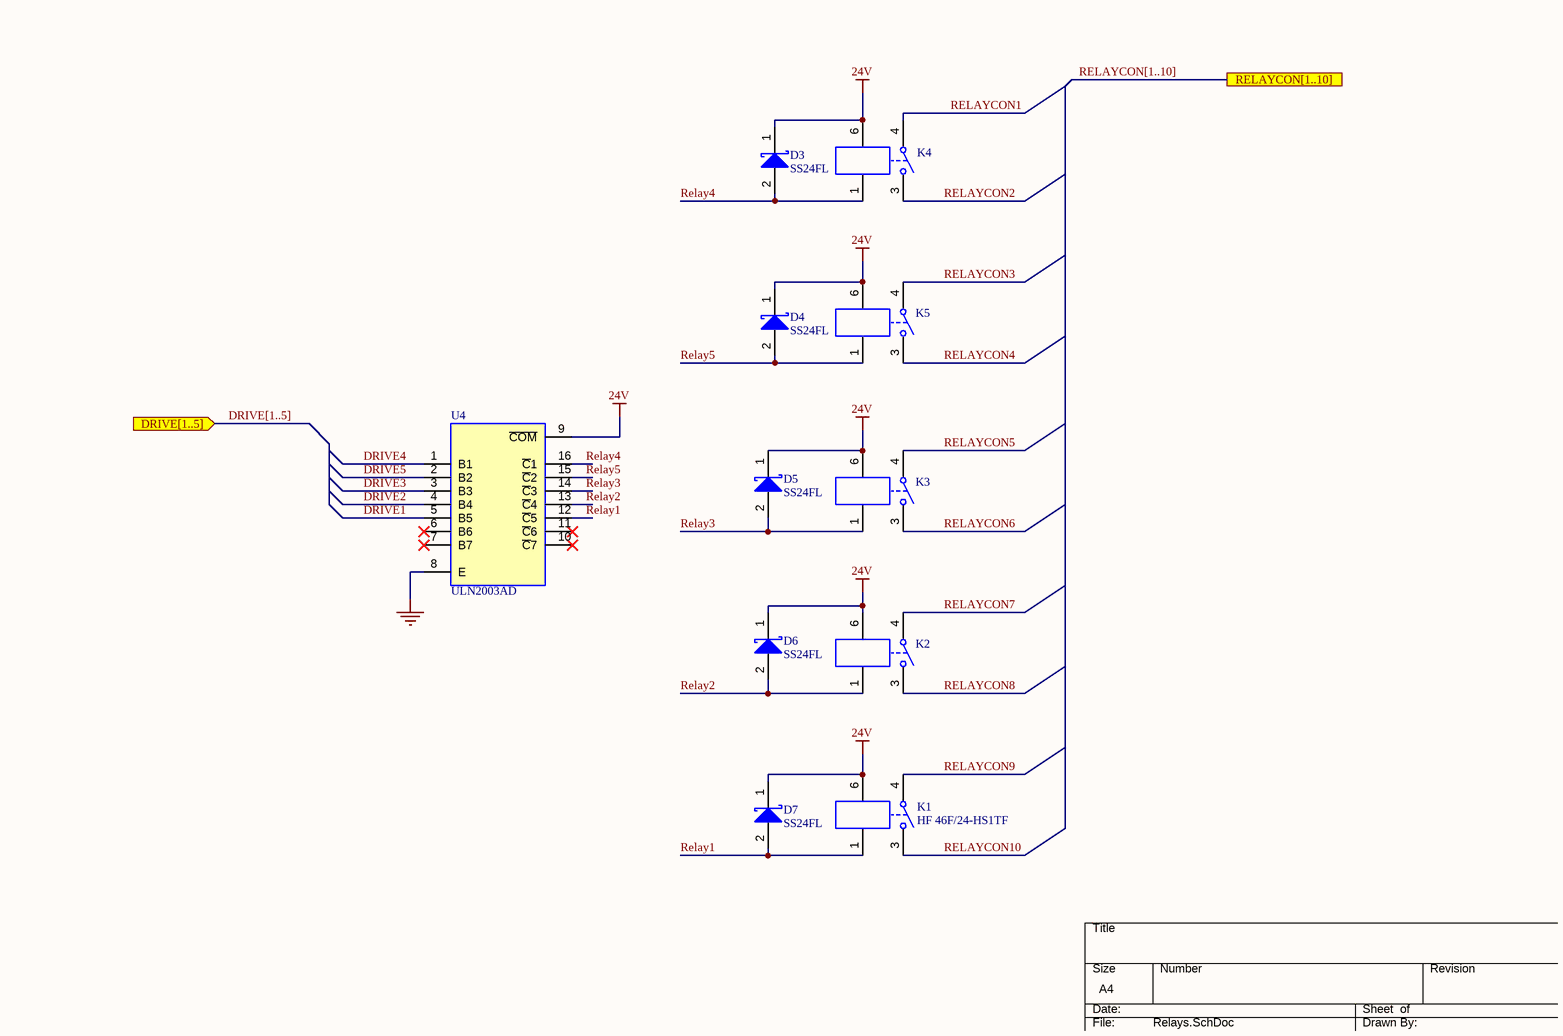
[diagram p4: Relays.SchDoc]

### Parts
D3  SS24FL  [SOD-123F]
D4  SS24FL  [SOD-123F]
D5  SS24FL  [SOD-123F]
D6  SS24FL  [SOD-123F]
D7  SS24FL  [SOD-123F]
K1  HF 46F/24-HS1TF  [G6BU-1114P]
K2  HF 46F/24-HS1TF  [G6BU-1114P]  (value not drawn)
K3  HF 46F/24-HS1TF  [G6BU-1114P]  (value not drawn)
K4  HF 46F/24-HS1TF  [G6BU-1114P]  (value not drawn)
K5  HF 46F/24-HS1TF  [G6BU-1114P]  (value not drawn)
U4  ULN2003AD  [SOIC-16]

### Ports
DRIVE[1..5] (in), RELAYCON[1..10]

### Nets
24V: D3.1(K) D4.1(K) D5.1(K) D6.1(K) D7.1(K) K1.6 K2.6 K3.6 K4.6 K5.6 U4.9(~{COM})
GND: U4.8(E)
DRIVE1: U4.5(B5)
DRIVE2: U4.4(B4)
DRIVE3: U4.3(B3)
DRIVE4: U4.1(B1)
DRIVE5: U4.2(B2)
Relay1: D7.2(A) K1.1 U4.12(~{C}5)
Relay2: D6.2(A) K2.1 U4.13(~{C}4)
Relay3: D5.2(A) K3.1 U4.14(~{C}3)
Relay4: D3.2(A) K4.1 U4.16(~{C}1)
Relay5: D4.2(A) K5.1 U4.15(~{C}2)
RELAYCON1: K4.4
RELAYCON2: K4.3
RELAYCON3: K5.4
RELAYCON4: K5.3
RELAYCON5: K3.4
RELAYCON6: K3.3
RELAYCON7: K2.4
RELAYCON8: K2.3
RELAYCON9: K1.4
RELAYCON10: K1.3

Not connected (* = marked no-connect by the designer): U4 6(B6)* 7(B7)* 10(~{C}7)* 11(~{C}6)*

### Buses and harness runs
bus DRIVE[1..5] = port DRIVE[1..5]
bus RELAYCON[1..10] = port RELAYCON[1..10]

### Notes on the sheet
- THIS DOCUMENT AND THE DATA DISCLOSED HEREIN OR
- HEREWITH IS THE PROPERTY OF ALTIUM LIMITED AND MAY
- DWG NO:
- REVISION
- REV:
- DESCRIPTION
- DATE
- APPROVED
- BE FREELY DISTRIBUTED IN WHOLE. NO RIGHTS ARE
- RESERVED OR EXPRESS OR IMPLIED WARANTEE GIVEN.
- ENG:
- APPROVALS
- PROJECT
- DSN:
- CHK:
- REFERENCE DOCUMENTS
- PROJECT REVISION:
- TITLE
- DOCUMENT REVISION:
- DESIGN ITEM:
- BOM:
- FAB DWG:
- PCB DWG:
- ASSY DWG:
- SCALE:
- A3
- SIZE
- CAGE CODE
- FILE NAME
- DWG NO.
- SHEET
- OF
- REV

### Library data of the parts
D3-D7 = DIS-000000002: MAN: ON Semiconductor / Fairchild; DES: Schottky Diodes & Rectifiers 40V, 2A SCHOTTKY; Value 1: 2A; Value 2: 40V; TOL: _; FTP: SOD-123-2; SUP: Mouser; SUPREF: 512-SS24FL; Part Number: DIS-000000002; MANREF: SS24FL; NOTE: _
K1-K5 = RLY-000000002: MAN: HONGFA RELAY; DES: Relais 24V SPST; Value 1: 5A; Value 2: 24VDC; TOL: _; FTP: THT; SUP: AGCONSEILS; Part Number: RLY-000000002; MANREF: HF 46F/24-HS1TF; SUPREF: HF 46F/24-HS1TF; NOTE: _
U4 = ICD-000000003: MAN: Texas Instruments; DES: Darlington Transistors Darlington; Value 1: _; SUP: Mouser; SUPREF: 595-ULN2003AD; Part Number: ICD-000000003; MANREF: ULN2003AD; Value 2: _; TOL: _; FTP: SOIC-16; NOTE: _

## Sheet Sensor Power Supply.SchDoc: Sensor Power Supply
size A4; Engineer: M.GUENI; Organization: Altium Limited; Address1: L3, 12a Rodborough Rd; Address2: Frenchs Forest; Address3: NSW; Address4: Australia 2086; Revision: R0; SheetNumber: 7; SheetTotal: 8
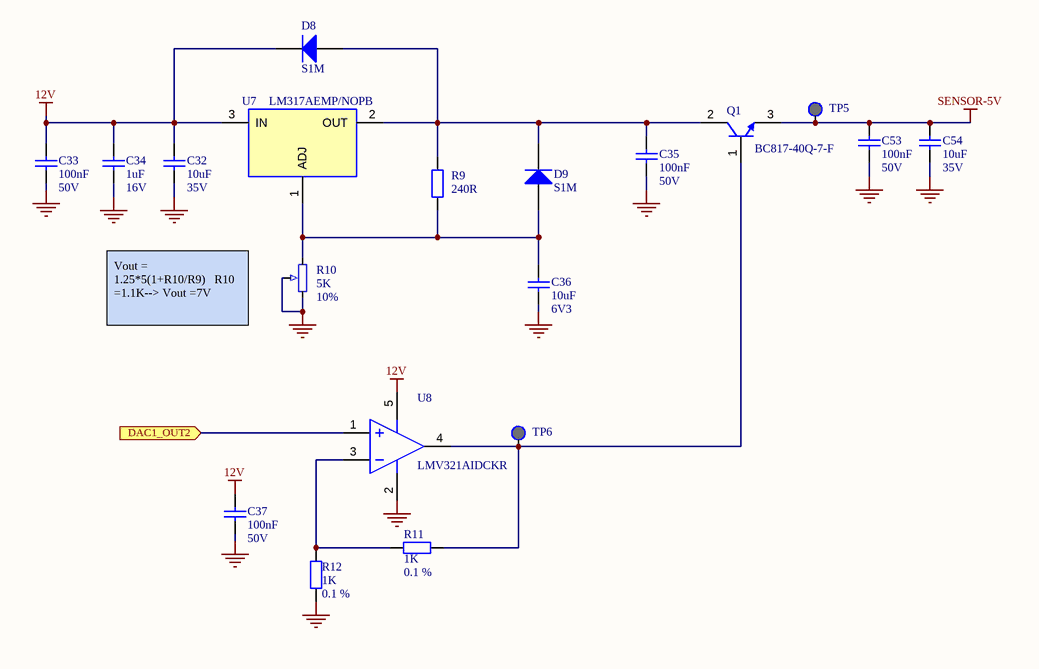
[diagram p5: Sensor Power Supply.SchDoc]

### Parts
C32  Value 1: 10uF  Value 2: 35V  [CAPC1608N]  (hidden comment: Capacitor)
C33  Value 1: 100nF  Value 2: 50V  [CAPC1608N]  (hidden comment: Capacitor)
C34  Value 1: 1uF  Value 2: 16V  [CAPC1608N]  (hidden comment: Capacitor)
C35  Value 1: 100nF  Value 2: 50V  [CAPC1608N]  (hidden comment: Capacitor)
C36  Value 1: 10uF  Value 2: 6V3  [CAPC2012N]  (hidden comment: Capacitor)
C37  Value 1: 100nF  Value 2: 50V  [CAPC1608N]  (hidden comment: Capacitor)
C53  Value 1: 100nF  Value 2: 50V  [CAPC1608N]  (hidden comment: Capacitor)
C54  Value 1: 10uF  Value 2: 35V  [CAPC1608N]  (hidden comment: Capacitor)
D8  S1M  [DIOM5227X270N]
D9  S1M  [DIOM5227X270N]
Q1  BC817-40Q-7-F  [SOT23-3N]
R9  Value 1: 240R  [RESC1608N]  (hidden comment: Resistor)
R10  Value 1: 5K  TOL: 10%  [3296W-1-502RLF]  (hidden comment: 3296W-1-502RLF)
R11  Value 1: 1K  TOL: 0.1 %  [RESC1608N]  (hidden comment: Resistor)
R12  Value 1: 1K  TOL: 0.1 %  [RESC1608N]  (hidden comment: Resistor)
TP5  Test Point  [TP]  (value not drawn)  (no BOM)
TP6  Test Point  [TP]  (value not drawn)  (no BOM)
U7  LM317AEMP/NOPB  [SOT-223-4]
U8  LMV321AIDCKR  [SC-70-5]

### Ports
DAC1_OUT2 (in)

### Nets
12V: C32.1 C33.1 C34.1 C37.1 D8.1(K) U7.3(IN) U8.5(+V)
GND: C32.2 C33.2 C34.2 C35.2 C36.2 C37.2 C53.2 C54.2 R10.2 R10.3 R12.2 U8.2(-V)
SENSOR-5V: C53.1 C54.1 Q1.3(E) TP5.1
NetC35_1: C35.1 D8.2(A) D9.1(K) Q1.2(C) R9.2 U7.2(OUT)
NetC36_1: C36.1 D9.2(A) R9.1 R10.1 U7.1(ADJ)
NetQ1_1: Q1.1(B) R11.1 TP6.1 U8.4(OUT)
NetR11_2: R11.2 R12.1 U8.3(-IN)
NetU6_30: U8.1(+IN) ; port DAC1_OUT2

### Notes on the sheet
- (near R10) Vout = 1.25*5(1+R10/R9)   R10 =1.1K--> Vout =7V
- THIS DOCUMENT AND THE DATA DISCLOSED HEREIN OR
- HEREWITH IS THE PROPERTY OF ALTIUM LIMITED AND MAY
- DWG NO:
- REVISION
- REV:
- DESCRIPTION
- DATE
- APPROVED
- BE FREELY DISTRIBUTED IN WHOLE. NO RIGHTS ARE
- RESERVED OR EXPRESS OR IMPLIED WARANTEE GIVEN.
- ENG:
- APPROVALS
- PROJECT
- DSN:
- CHK:
- REFERENCE DOCUMENTS
- PROJECT REVISION:
- TITLE
- DOCUMENT REVISION:
- DESIGN ITEM:
- BOM:
- FAB DWG:
- PCB DWG:
- ASSY DWG:
- SCALE:
- A3
- SIZE
- CAGE CODE
- FILE NAME
- DWG NO.
- SHEET
- OF
- REV

### Library data of the parts
C32 C54 = CAP-000000006: as C58 on sheet Connectors; Part Number: CAP-000000006
C33 C35 C37 C53 = CAP-000000002: as C57 on sheet Connectors; Part Number: CAP-000000002
C34 = CAP-000000011: MAN: MULTICOMP; MANREF: MC0603F105Z160CT; DES: MULTICOMP 	MC0603F105Z160CT  Condensateur céramique multicouche CMS, Série MC, 1 µF, +80%, -20%, Y5V, 16 V, 0603 [1608 Metric]; TOL: +80% -20%; FTP: 0603; SUP: Farnell; SUPREF: 1759408; NOTE: _; Part Number: CAP-000000011
C36 = CAP-000000001: MAN: MULTICOMP; MANREF: MCTT21X106M6R3CT; DES: MCTT21X106M6R3CT -  Condensateur céramique multicouche CMS, 10 µF, 6.3 V, 0805 [2012 Metric], ± 20%, X5R, Série MCTT; TOL: 20%; FTP: 0805; SUP: Farnell; SUPREF: 1759476; NOTE: _; Part Number: CAP-000000001
D8 D9 = DIR-000000001: as D1 on sheet Connectors; Part Number: DIR-000000001; MANREF: S1M; NOTE: _
Q1 = TRP-000000008: MAN: Diodes Incorporated; DES: Bipolar Transistors - BJT SS Low Sat Transistor; Value 1: 0.5A; Value 2: 45V; TOL: _; FTP: SOT-23; SUP: Mouser; SUPREF: 621-BC817-40Q-7-F; Part Number: TRP-000000008; MANREF: BC817-40Q-7-F; NOTE: _
R9 = RES-000000110: MAN: MULTICOMP PRO; MANREF: MCWR06X2400FTL; DES: Résistance à puce CMS, Couche épaisse, 240 ohm, ± 1%, 100 mW, 0603 [1608 Metric], Couche épaisse; Value 2: 0.1W; TOL: 1%; FTP: 0603; SUP: Farnell; SUPREF: 2447305; NOTE: _; Part Number: RES-000000110
R10 = RES-000000111: MAN: Bourns; DES: Trimmer Resistors - Through Hole 3/8" 5Kohms Sealed Vertical Adjust; Value 2: 0.5W; FTP: THT; SUP: Mouser; SUPREF: 652-3296W-1-502RLF; NOTE: _; Part Number: RES-000000111; MANREF: 3296W-1-502RLF
R11 R12 = RES-000000112: as R14 on sheet OP AMPS; Part Number: RES-000000112
TP5 TP6 = MIS-000000003: MAN: _; Part Number: MIS-000000003; MANREF: _; DES: _; Value 1: _; Value 2: _; TOL: _; FTP: _; SUP: _; SUPREF: _; NOTE: _
U7 = VRG-000000016: MAN: Texas Instruments; DES: Linear Voltage Regulators 3-TERMINAL ADJ REG; Value 1: 1.2 V to 37 V; Value 2: 1A; TOL: _; SUP: Mouser; SUPREF: 926-LM317AEMP/NOPB; Part Number: VRG-000000016; MANREF: LM317AEMP/NOPB; FTP: SOT-223-4; NOTE: _
U8 = OPA-000000001: MAN: Texas Instrument; DES: Operational Amplifiers - Op Amps Single Low-Voltage, Cost-Optimized Rail-to-Rail Output Operational Amplifier 5-SC70 -40 to 125; Value 1: _; SUP: Mouser; SUPREF: 595-LMV321AIDCKR; Part Number: OPA-000000001; MANREF: LMV321AIDCKR; Value 2: _; TOL: _; FTP: SC-70-5; NOTE: _

## Sheet USB.SchDoc: USB-PROGRAMMER
size A4; Engineer: M.GUENI; Revision: R0; SheetNumber: 6; SheetTotal: 8
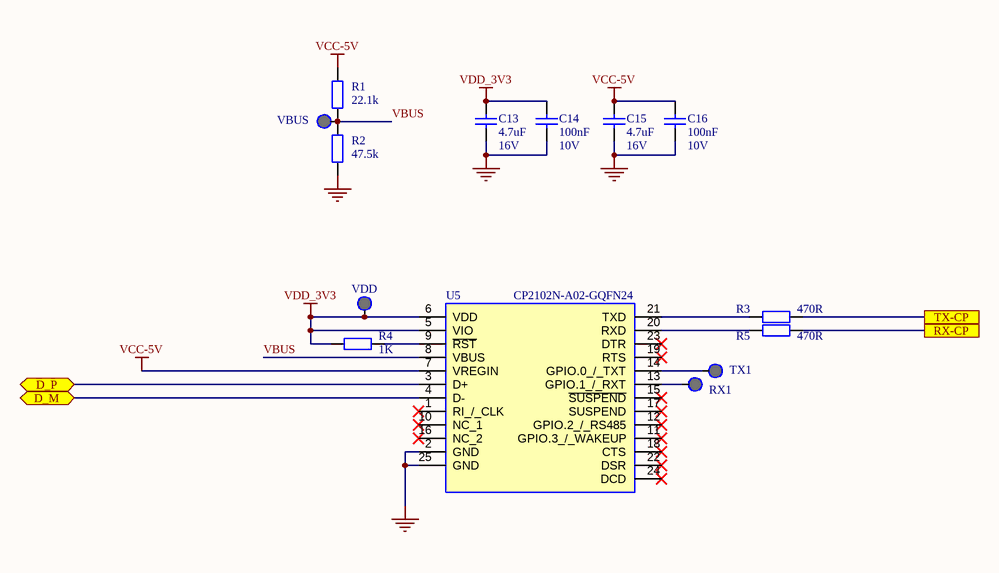
[diagram p6: USB.SchDoc]

### Parts
C13  Value 1: 4.7uF  Value 2: 16V  [CAPC1608N]  (hidden comment: Capacitor)
C14  Value 1: 100nF  Value 2: 10V  [CAPC1608N]  (hidden comment: Capacitor)
C15  Value 1: 4.7uF  Value 2: 16V  [CAPC1608N]  (hidden comment: Capacitor)
C16  Value 1: 100nF  Value 2: 10V  [CAPC1608N]  (hidden comment: Capacitor)
R1  Value 1: 22.1k  [RESC1608N]  (hidden comment: Resistor)
R2  Value 1: 47.5k  [RESC1608N]  (hidden comment: Resistor)
R3  Value 1: 470R  [RESC1608N]  (hidden comment: Resistor)
R4  Value 1: 1K  [RESC1608N]  (hidden comment: Resistor)
R5  Value 1: 470R  [RESC1608N]  (hidden comment: Resistor)
RX1  Test Point  [TP]  (value not drawn)  (no BOM)
TX1  Test Point  [TP]  (value not drawn)  (no BOM)
U5  CP2102N-A02-GQFN24  [QFN-24]
VBUS  Test Point  [TP]  (value not drawn)  (no BOM)
VDD  Test Point  [TP]  (value not drawn)  (no BOM)

### Ports
D_M (bidir), D_P (bidir), RX-CP, TX-CP

### Nets
GND: C13.1 C14.1 C15.1 C16.1 R2.2 U5.2(GND) U5.25(GND)
VCC-5V: C15.2 C16.2 R1.1 U5.7(VREGIN)
VDD_3V3: C13.2 C14.2 R4.1 U5.5(VIO) U5.6(VDD) VDD.1
VBUS: R1.2 R2.1 U5.8(VBUS) VBUS.1
NetD2_2: U5.4(D-) ; port D_M
NetD2_3: U5.3(D+) ; port D_P
NetR3_1: R3.1 ; port TX-CP
NetR3_2: R3.2 U5.21(TXD)
NetR4_2: R4.2 U5.9(~{RST})
NetR5_1: R5.1 ; port RX-CP
NetR5_2: R5.2 U5.20(RXD)
NetRX1_1: RX1.1 U5.13(GPIO.1_/_RXT)
NetTX1_1: TX1.1 U5.14(GPIO.0_/_TXT)

Not connected (* = marked no-connect by the designer): U5 1(RI_/_CLK)* 10(NC_1)* 11(GPIO.3_/_WAKEUP)* 12(GPIO.2_/_RS485)* 15(~{SUSPEND})* 16(NC_2)* 17(SUSPEND)* 18(CTS)* 19(RTS)* 22(DSR)* 23(DTR)* 24(DCD)*

### Notes on the sheet
- THIS DOCUMENT AND THE DATA DISCLOSED HEREIN OR
- HEREWITH IS THE PROPERTY OF ALTIUM LIMITED AND MAY
- DWG NO:
- REVISION
- REV:
- DESCRIPTION
- DATE
- APPROVED
- BE FREELY DISTRIBUTED IN WHOLE. NO RIGHTS ARE
- RESERVED OR EXPRESS OR IMPLIED WARANTEE GIVEN.
- ENG:
- APPROVALS
- PROJECT
- DSN:
- CHK:
- REFERENCE DOCUMENTS
- PROJECT REVISION:
- TITLE
- DOCUMENT REVISION:
- DESIGN ITEM:
- BOM:
- FAB DWG:
- PCB DWG:
- ASSY DWG:
- SCALE:
- A3
- SIZE
- CAGE CODE
- FILE NAME
- DWG NO.
- SHEET
- OF
- REV

### Library data of the parts
C13 C15 = CAP-000000047: MAN: Murata Electronics; MANREF: GRM188C71C475KE21D; DES: Multilayer Ceramic Capacitors MLCC - SMD/SMT 4.7UF 16V 10% 0603; TOL: 10%; FTP: 0603; SUP: Mouser; SUPREF: 81-GRM188C71C475KE1D; NOTE: _; Part Number: CAP-000000047
C14 C16 = CAP-000000005: as C59 on sheet Connectors; Part Number: CAP-000000005
R1 = RES-000000017: MAN: Panasonic; MANREF: ERA-3AED2212V; DES: Thin Film Resistors - SMD 0603 22.1Kohms 25ppm 0.5% AEC-Q200; Value 2: 0.1W; TOL: 0.5%; FTP: 0603; SUP: Mouser; SUPREF: 667-ERA-3AED2212V; NOTE: _; Part Number: RES-000000017
R2 = RES-000000018: MAN: Vishay / Dale; MANREF: CRCW060347K5FKEA; DES: Thick Film Resistors - SMD 1/10watt 47.5Kohms 1%; Value 2: 0.1W; TOL: 1%; FTP: 0603; SUP: Mouser; SUPREF: 71-CRCW0603-47.5K-E3; NOTE: _; Part Number: RES-000000018
R3 R5 = RES-000000016: MAN: YAGEO; MANREF: RC0603FR-10470RL; DES: Thick Film Resistors - SMD 470 OHM 1%; Value 2: 0.1W; TOL: 1%; FTP: 0603; SUP: Mouser; SUPREF: 603-RC0603FR-10470RL; NOTE: _; Part Number: RES-000000016
R4 = RES-000000006: as R13 on sheet Connectors; Part Number: RES-000000006
RX1 TX1 VBUS VDD = MIS-000000003: MAN: _; Part Number: MIS-000000003; MANREF: _; DES: _; Value 1: _; Value 2: _; TOL: _; FTP: _; SUP: _; SUPREF: _; NOTE: _
U5 = MIS-000000025: MAN: SILICON LABS; DES: Circuit intégré d'interface USB USBXpress - USB to UART Bridge QFN24; Value 1: _; SUP: Mouser; SUPREF: 634-CP2102NA02GQFN24; Part Number: MIS-000000025; MANREF: CP2102N-A02-GQFN24; Value 2: _; TOL: _; FTP: QFN-24; NOTE: _

## Sheet MCU.SchDoc: MCU Circuit
size A4; Engineer: M.GUENI; Organization: Altium Limited; Address1: L3, 12a Rodborough Rd; Address2: Frenchs Forest; Address3: NSW; Address4: Australia 2086; Revision: R0; SheetNumber: 8; SheetTotal: 8
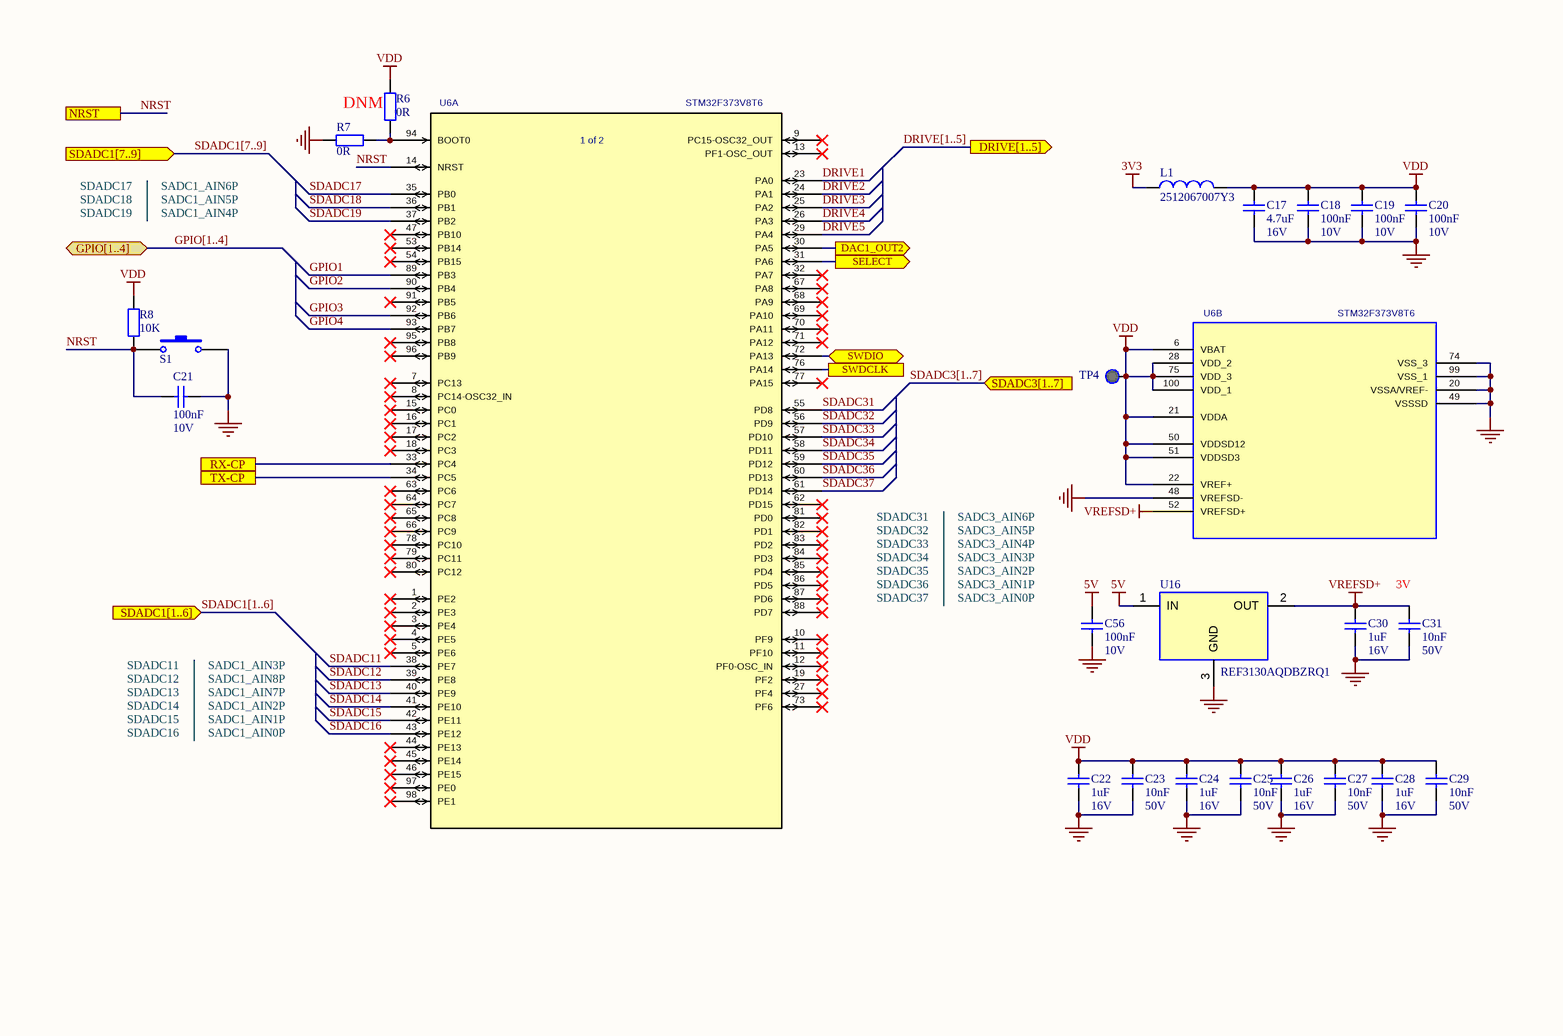
[diagram p7: MCU.SchDoc]

### Parts
C17  Value 1: 4.7uF  Value 2: 16V  [CAPC1608N]  (hidden comment: Capacitor)
C18  Value 1: 100nF  Value 2: 10V  [CAPC1608N]  (hidden comment: Capacitor)
C19  Value 1: 100nF  Value 2: 10V  [CAPC1608N]  (hidden comment: Capacitor)
C20  Value 1: 100nF  Value 2: 10V  [CAPC1608N]  (hidden comment: Capacitor)
C21  Value 1: 100nF  Value 2: 10V  [CAPC1608N]  (hidden comment: Capacitor)
C22  Value 1: 1uF  Value 2: 16V  [CAPC1608N]  (hidden comment: Capacitor)
C23  Value 1: 10nF  Value 2: 50V  [CAPC1608N]  (hidden comment: Capacitor)
C24  Value 1: 1uF  Value 2: 16V  [CAPC1608N]  (hidden comment: Capacitor)
C25  Value 1: 10nF  Value 2: 50V  [CAPC1608N]  (hidden comment: Capacitor)
C26  Value 1: 1uF  Value 2: 16V  [CAPC1608N]  (hidden comment: Capacitor)
C27  Value 1: 10nF  Value 2: 50V  [CAPC1608N]  (hidden comment: Capacitor)
C28  Value 1: 1uF  Value 2: 16V  [CAPC1608N]  (hidden comment: Capacitor)
C29  Value 1: 10nF  Value 2: 50V  [CAPC1608N]  (hidden comment: Capacitor)
C30  Value 1: 1uF  Value 2: 16V  [CAPC1608N]  (hidden comment: Capacitor)
C31  Value 1: 10nF  Value 2: 50V  [CAPC1608N]  (hidden comment: Capacitor)
C56  Value 1: 100nF  Value 2: 10V  [CAPC1608N]  (hidden comment: Capacitor)
L1  2512067007Y3  [INDC3216N]
R6  Value 1: 0R  [RESC1608N]  (hidden comment: Resistor)
R7  Value 1: 0R  [RESC1608N]  (hidden comment: Resistor)
R8  Value 1: 10K  [RESC1608N]  (hidden comment: Resistor)
S1  FSM4JSMA  [FSM4]  (value not drawn)
TP4  Test Point  [TP]  (value not drawn)  (no BOM)
U6  STM32F373V8T6  [LQFP100]  (parts A,B of 2)
U16  REF3130AQDBZRQ1  [SOT23-3N]

### Ports
DAC1_OUT2 (out), DRIVE[1..5] (out), GPIO[1..4] (bidir), NRST, RX-CP, SDADC1[1..6] (in), SDADC1[7..9] (in), SDADC3[1..7] (in), SELECT (out), SWDCLK, SWDIO (bidir), TX-CP

### Nets
3V3: L1.1
5V: C56.2 U16.1(IN)
GND: C17.2 C18.1 C19.1 C20.1 C21.1 C22.1 C23.1 C24.1 C25.1 C26.1 C27.1 C28.1 C29.1 C30.1 C31.1 C56.1 R7.1 S1.2 U6.20(VSSA/VREF-) U6.48(VREFSD-) U6.49(VSSSD) U6.74(VSS_3) U6.99(VSS_1) U16.3(GND)
VDD: C17.1 C18.2 C19.2 C20.2 C22.2 C23.2 C24.2 C25.2 C26.2 C27.2 C28.2 C29.2 L1.2 R6.2 R8.1 TP4.1 U6.6(VBAT) U6.21(VDDA) U6.22(VREF+) U6.28(VDD_2) U6.50(VDDSD12) U6.51(VDDSD3) U6.75(VDD_3) U6.100(VDD_1)
VREFSD+: C30.2 C31.2 U6.52(VREFSD+) U16.2(OUT)
DRIVE1: U6.23(PA0)
DRIVE2: U6.24(PA1)
DRIVE3: U6.25(PA2)
DRIVE4: U6.26(PA3)
DRIVE5: U6.29(PA4)
GPIO1: U6.89(PB3)
GPIO2: U6.90(PB4)
GPIO3: U6.92(PB6)
GPIO4: U6.93(PB7)
NRST: C21.2 R8.2 S1.1 U6.14(NRST) ; port NRST
SDADC11: U6.38(PE7)
SDADC12: U6.39(PE8)
SDADC13: U6.40(PE9)
SDADC14: U6.41(PE10)
SDADC15: U6.42(PE11)
SDADC16: U6.43(PE12)
SDADC17: U6.35(PB0)
SDADC18: U6.36(PB1)
SDADC19: U6.37(PB2)
SDADC31: U6.55(PD8)
SDADC32: U6.56(PD9)
SDADC33: U6.57(PD10)
SDADC34: U6.58(PD11)
SDADC35: U6.59(PD12)
SDADC36: U6.60(PD13)
SDADC37: U6.61(PD14)
SELECT: U6.31(PA6) ; port SELECT
NetJ11_1: U6.76(PA14) ; port SWDCLK
NetJ11_5: U6.72(PA13) ; port SWDIO
NetR3_1: U6.33(PC4) ; port RX-CP
NetR5_1: U6.34(PC5) ; port TX-CP
NetR6_1: R6.1 R7.2 U6.94(BOOT0)
NetU6_30: U6.30(PA5) ; port DAC1_OUT2

Not connected (* = marked no-connect by the designer): U6 1(PE2)* 2(PE3)* 3(PE4)* 4(PE5)* 5(PE6)* 7(PC13)* 8(PC14-OSC32_IN)* 9(PC15-OSC32_OUT)* 10(PF9)* 11(PF10)* 12(PF0-OSC_IN)* 13(PF1-OSC_OUT)* 15(PC0)* 16(PC1)* 17(PC2)* 18(PC3)* 19(PF2)* 27(PF4)* 32(PA7)* 44(PE13)* 45(PE14)* 46(PE15)* 47(PB10)* 53(PB14)* 54(PB15)* 62(PD15)* 63(PC6)* 64(PC7)* 65(PC8)* 66(PC9)* 67(PA8)* 68(PA9)* 69(PA10)* 70(PA11)* 71(PA12)* 73(PF6)* 77(PA15)* 78(PC10)* 79(PC11)* 80(PC12)* 81(PD0)* 82(PD1)* 83(PD2)* 84(PD3)* 85(PD4)* 86(PD5)* 87(PD6)* 88(PD7)* 91(PB5)* 95(PB8)* 96(PB9)* 97(PE0)* 98(PE1)*

### Buses and harness runs
bus DRIVE[1..5] = port DRIVE[1..5]
bus GPIO[1..4] = port GPIO[1..4]
bus SDADC1[1..6] = port SDADC1[1..6]
bus SDADC1[7..9] = port SDADC1[7..9]
bus SDADC3[1..7] = port SDADC3[1..7]

### Notes on the sheet
- DNM
- SDADC18
- SDADC17
- SDADC19
- SADC1_AIN6P
- SADC1_AIN5P
- SADC1_AIN4P
- SDADC31
- SADC3_AIN6P
- SDADC32
- SDADC33
- SDADC34
- SDADC35
- SADC3_AIN5P
- SADC3_AIN4P
- SADC3_AIN3P
- SADC3_AIN2P
- SDADC36
- SDADC37
- SADC3_AIN1P
- SADC3_AIN0P
- (near C31) 3V
- SDADC11
- SDADC12
- SDADC13
- SDADC14
- SADC1_AIN3P
- SADC1_AIN8P
- SADC1_AIN7P
- SADC1_AIN2P
- SDADC15
- SDADC16
- SADC1_AIN1P
- SADC1_AIN0P
- THIS DOCUMENT AND THE DATA DISCLOSED HEREIN OR
- HEREWITH IS THE PROPERTY OF ALTIUM LIMITED AND MAY
- DWG NO:
- REVISION
- REV:
- DESCRIPTION
- DATE
- APPROVED
- BE FREELY DISTRIBUTED IN WHOLE. NO RIGHTS ARE
- RESERVED OR EXPRESS OR IMPLIED WARANTEE GIVEN.
- ENG:
- APPROVALS
- PROJECT
- DSN:
- CHK:
- REFERENCE DOCUMENTS
- PROJECT REVISION:
- TITLE
- DOCUMENT REVISION:
- DESIGN ITEM:
- BOM:
- FAB DWG:
- PCB DWG:
- ASSY DWG:
- SCALE:
- A3
- SIZE
- CAGE CODE
- FILE NAME
- DWG NO.
- SHEET
- OF
- REV
- (in symbol MCU-000000001, part A) 1 of 2
- (in symbol MCU-000000001, part B) 2 of 2

### Library data of the parts
C17 = CAP-000000047: as C13 on sheet USB; Part Number: CAP-000000047
C18-C21 C56 = CAP-000000005: as C59 on sheet Connectors; Part Number: CAP-000000005
C22 C24 C26 C28 C30 = CAP-000000011: as C34 on sheet Sensor Power Supply; Part Number: CAP-000000011
C23 C25 C27 C29 C31 = CAP-000000003: MAN: MULTICOMP; MANREF: 06035C103JAT2A; DES: 06035C103JAT2A -  Condensateur céramique multicouche CMS, 10000 pF, 50 V, 0603 [1608 Metric], ± 5%, X7R; TOL: 5%; FTP: 0603; SUP: Farnell; SUPREF: 1833871; NOTE: _; Part Number: CAP-000000003
L1 = FER-000000001: MAN: FAIR-RITE; DES: 2512067007Y3 -  Perle de ferrite, 1206 [3216 Metric], 70 ohm, 3 A, 0.04 ohm, ± 25%; Value 1: 70Ohm; Value 2: 0R04; TOL: 25%; FTP: 1206; SUP: Farnell; SUPREF: 1653393; NOTE: _; Part Number: FER-000000001; MANREF: 2512067007Y3
R6 R7 = RES-000000103: MAN: Vishay / Beyschlag; MANREF: MCT06030Z0000ZP500; DES: Thin Film Resistors - SMD Zero ohm Jumper; Value 2: 0.125W; TOL: _; FTP: 0603; SUP: Mouser; SUPREF: 594-MCT06030Z0000ZP5; Part Number: RES-000000103; NOTE: _
R8 = RES-000000001: as R49 on sheet Connectors; Part Number: RES-000000001
S1 = SWC-000000004: MAN: ALCOSWITCH - TE CONNECTIVITY; DES: Commutateur tactile, Série FSMJSMA, A déclencheur supérieur, Montage en surface, Bouton rond; Value 1: _; SUP: Farnell; SUPREF: 3801305; Part Number: SWC-000000004; MANREF: FSM4JSMA; Value 2: _; TOL: _; FTP: _; NOTE: _
TP4 = MIS-000000003: MAN: _; Part Number: MIS-000000003; MANREF: _; DES: _; Value 1: _; Value 2: _; TOL: _; FTP: _; SUP: _; SUPREF: _; NOTE: _
U6 = MCU-000000001: MAN: STMicroelectronics; DES: ARM Microcontrollers - MCU 32-Bit ARM Cortex M4 72MHz 64kB MCU FPU; Value 1: _; FTP: LQFP-100; SUP: Mouser; SUPREF: 511-STM32F373V8T6; Part Number: MCU-000000001; MANREF: STM32F373V8T6; Value 2: _; TOL: _; NOTE: _
U16 = VRF-000000001: MAN: Texas Instruments; DES: Voltage References Automotive 20-ppm/-C (max), 100--A, 3-pin SOT-23 series voltage reference 3-SOT-23 -40 to 125; Value 1: 3V; Value 2: _; TOL: 0.2 %; FTP: SOT-23-3; SUP: Mouser; SUPREF: 595-REF3130AQDBZRQ1; Part Number: VRF-000000001; MANREF: REF3130AQDBZRQ1; NOTE: _

## Nets that join several sheets
3V3: Connectors (8 pins), OP AMPS (28 pins), Power Supply (C1.2 C12.1 TP3.1 U3.3), MCU (L1.1)
5V: Connectors (J3.1 J4.1), OP AMPS (C38.2 U9.3 U9.4), Power Supply (7 pins), MCU (C56.2 U16.1)
12V: Power Supply (7 pins), Sensor Power Supply (7 pins)
24V: Connectors (D1.1), Power Supply (C2.1 C3.2 U1.1), Relays (11 pins)
GND: Connectors (25 pins), OP AMPS (71 pins), Power Supply (15 pins), Relays (U4.8), Sensor Power Supply (12 pins), USB (7 pins), MCU (24 pins)
SENSOR-5V: Connectors (C57.1 C58.1 J1.15 J1.16), Sensor Power Supply (C53.1 C54.1 Q1.3 TP5.1)
VCC-5V: Connectors (D2.4 J7.1), USB (C15.2 C16.2 R1.1 U5.7)
AUX1-IN: Connectors (J4.3), OP AMPS (R25.1)
AUX2-IN: Connectors (J4.5), OP AMPS (R16.1)
AUX3-IN: Connectors (J4.4), OP AMPS (R32.1)
AUX4-IN: Connectors (J4.6), OP AMPS (R33.1)
DRIVE1: Relays (U4.5), MCU (U6.23)
DRIVE2: Relays (U4.4), MCU (U6.24)
DRIVE3: Relays (U4.3), MCU (U6.25)
DRIVE4: Relays (U4.1), MCU (U6.26)
DRIVE5: Relays (U4.2), MCU (U6.29)
GPIO1: Connectors (R13.2), MCU (U6.89)
GPIO2: Connectors (R46.2), MCU (U6.90)
GPIO3: Connectors (R47.2), MCU (U6.92)
GPIO4: Connectors (R48.2), MCU (U6.93)
NetD2_2: Connectors (D2.2 J7.2), USB (U5.4)
NetD2_3: Connectors (D2.3 J7.3), USB (U5.3)
NetJ11_1: Connectors (J11.1), MCU (U6.76)
NetJ11_5: Connectors (J11.5), MCU (U6.72)
NetR3_1: USB (R3.1), MCU (U6.33)
NetR5_1: USB (R5.1), MCU (U6.34)
NetU6_30: Sensor Power Supply (U8.1), MCU (U6.30)
NRST: Connectors (J11.4), MCU (C21.2 R8.2 S1.1 U6.14)
PRESSURE-IN: Connectors (J3.2), OP AMPS (R17.1)
RELAYCON1: Connectors (J5.1), Relays (K4.4)
RELAYCON2: Connectors (J5.2), Relays (K4.3)
RELAYCON3: Connectors (J6.1), Relays (K5.4)
RELAYCON4: Connectors (J6.2), Relays (K5.3)
RELAYCON5: Connectors (J8.1), Relays (K3.4)
RELAYCON6: Connectors (J8.2), Relays (K3.3)
RELAYCON7: Connectors (J9.1), Relays (K2.4)
RELAYCON8: Connectors (J9.2), Relays (K2.3)
RELAYCON9: Connectors (J10.1), Relays (K1.4)
RELAYCON10: Connectors (J10.2), Relays (K1.3)
SDADC11: OP AMPS (U10.15), MCU (U6.38)
SDADC12: OP AMPS (U10.10), MCU (U6.39)
SDADC13: OP AMPS (U10.8), MCU (U6.40)
SDADC14: OP AMPS (U10.4), MCU (U6.41)
SDADC15: OP AMPS (U10.2), MCU (U6.42)
SDADC16: OP AMPS (U13.23), MCU (U6.43)
SDADC17: OP AMPS (U10.23), MCU (U6.35)
SDADC18: OP AMPS (U10.21), MCU (U6.36)
SDADC19: OP AMPS (U10.17), MCU (U6.37)
SDADC31: OP AMPS (U13.21), MCU (U6.55)
SDADC32: OP AMPS (U13.17), MCU (U6.56)
SDADC33: OP AMPS (U13.15), MCU (U6.57)
SDADC34: OP AMPS (U13.10), MCU (U6.58)
SDADC35: OP AMPS (U13.8), MCU (U6.59)
SDADC36: OP AMPS (U13.4), MCU (U6.60)
SDADC37: OP AMPS (U13.2), MCU (U6.61)
SELECT: OP AMPS (U10.24 U13.24), MCU (U6.31)
SENSOR0-IN: Connectors (J1.1), OP AMPS (R38.1)
SENSOR1-IN: Connectors (J1.3), OP AMPS (R22.1)
SENSOR2-IN: Connectors (J1.5), OP AMPS (R31.1)
SENSOR3-IN: Connectors (J1.7), OP AMPS (R41.1)
SENSOR4-IN: Connectors (J1.9), OP AMPS (R14.1)
SENSOR5-IN: Connectors (J1.2), OP AMPS (R39.1)
SENSOR6-IN: Connectors (J1.4), OP AMPS (R23.1)
SENSOR7-IN: Connectors (J1.6), OP AMPS (R30.1)
SENSOR8-IN: Connectors (J1.8), OP AMPS (R40.1)
SENSOR9-IN: Connectors (J1.10), OP AMPS (R15.1)
SENSOR-5V-FB: Connectors (J1.12), OP AMPS (R24.1)

## Assembly variants
Variant of CMA: all parts fitted